# EasyEDA Pro project ProDoc_Avaota Pi A_2024-08-17.epro, schematic Avaota Pi A, sheets 1 to 5 of 13

## Sheets
1 POWER
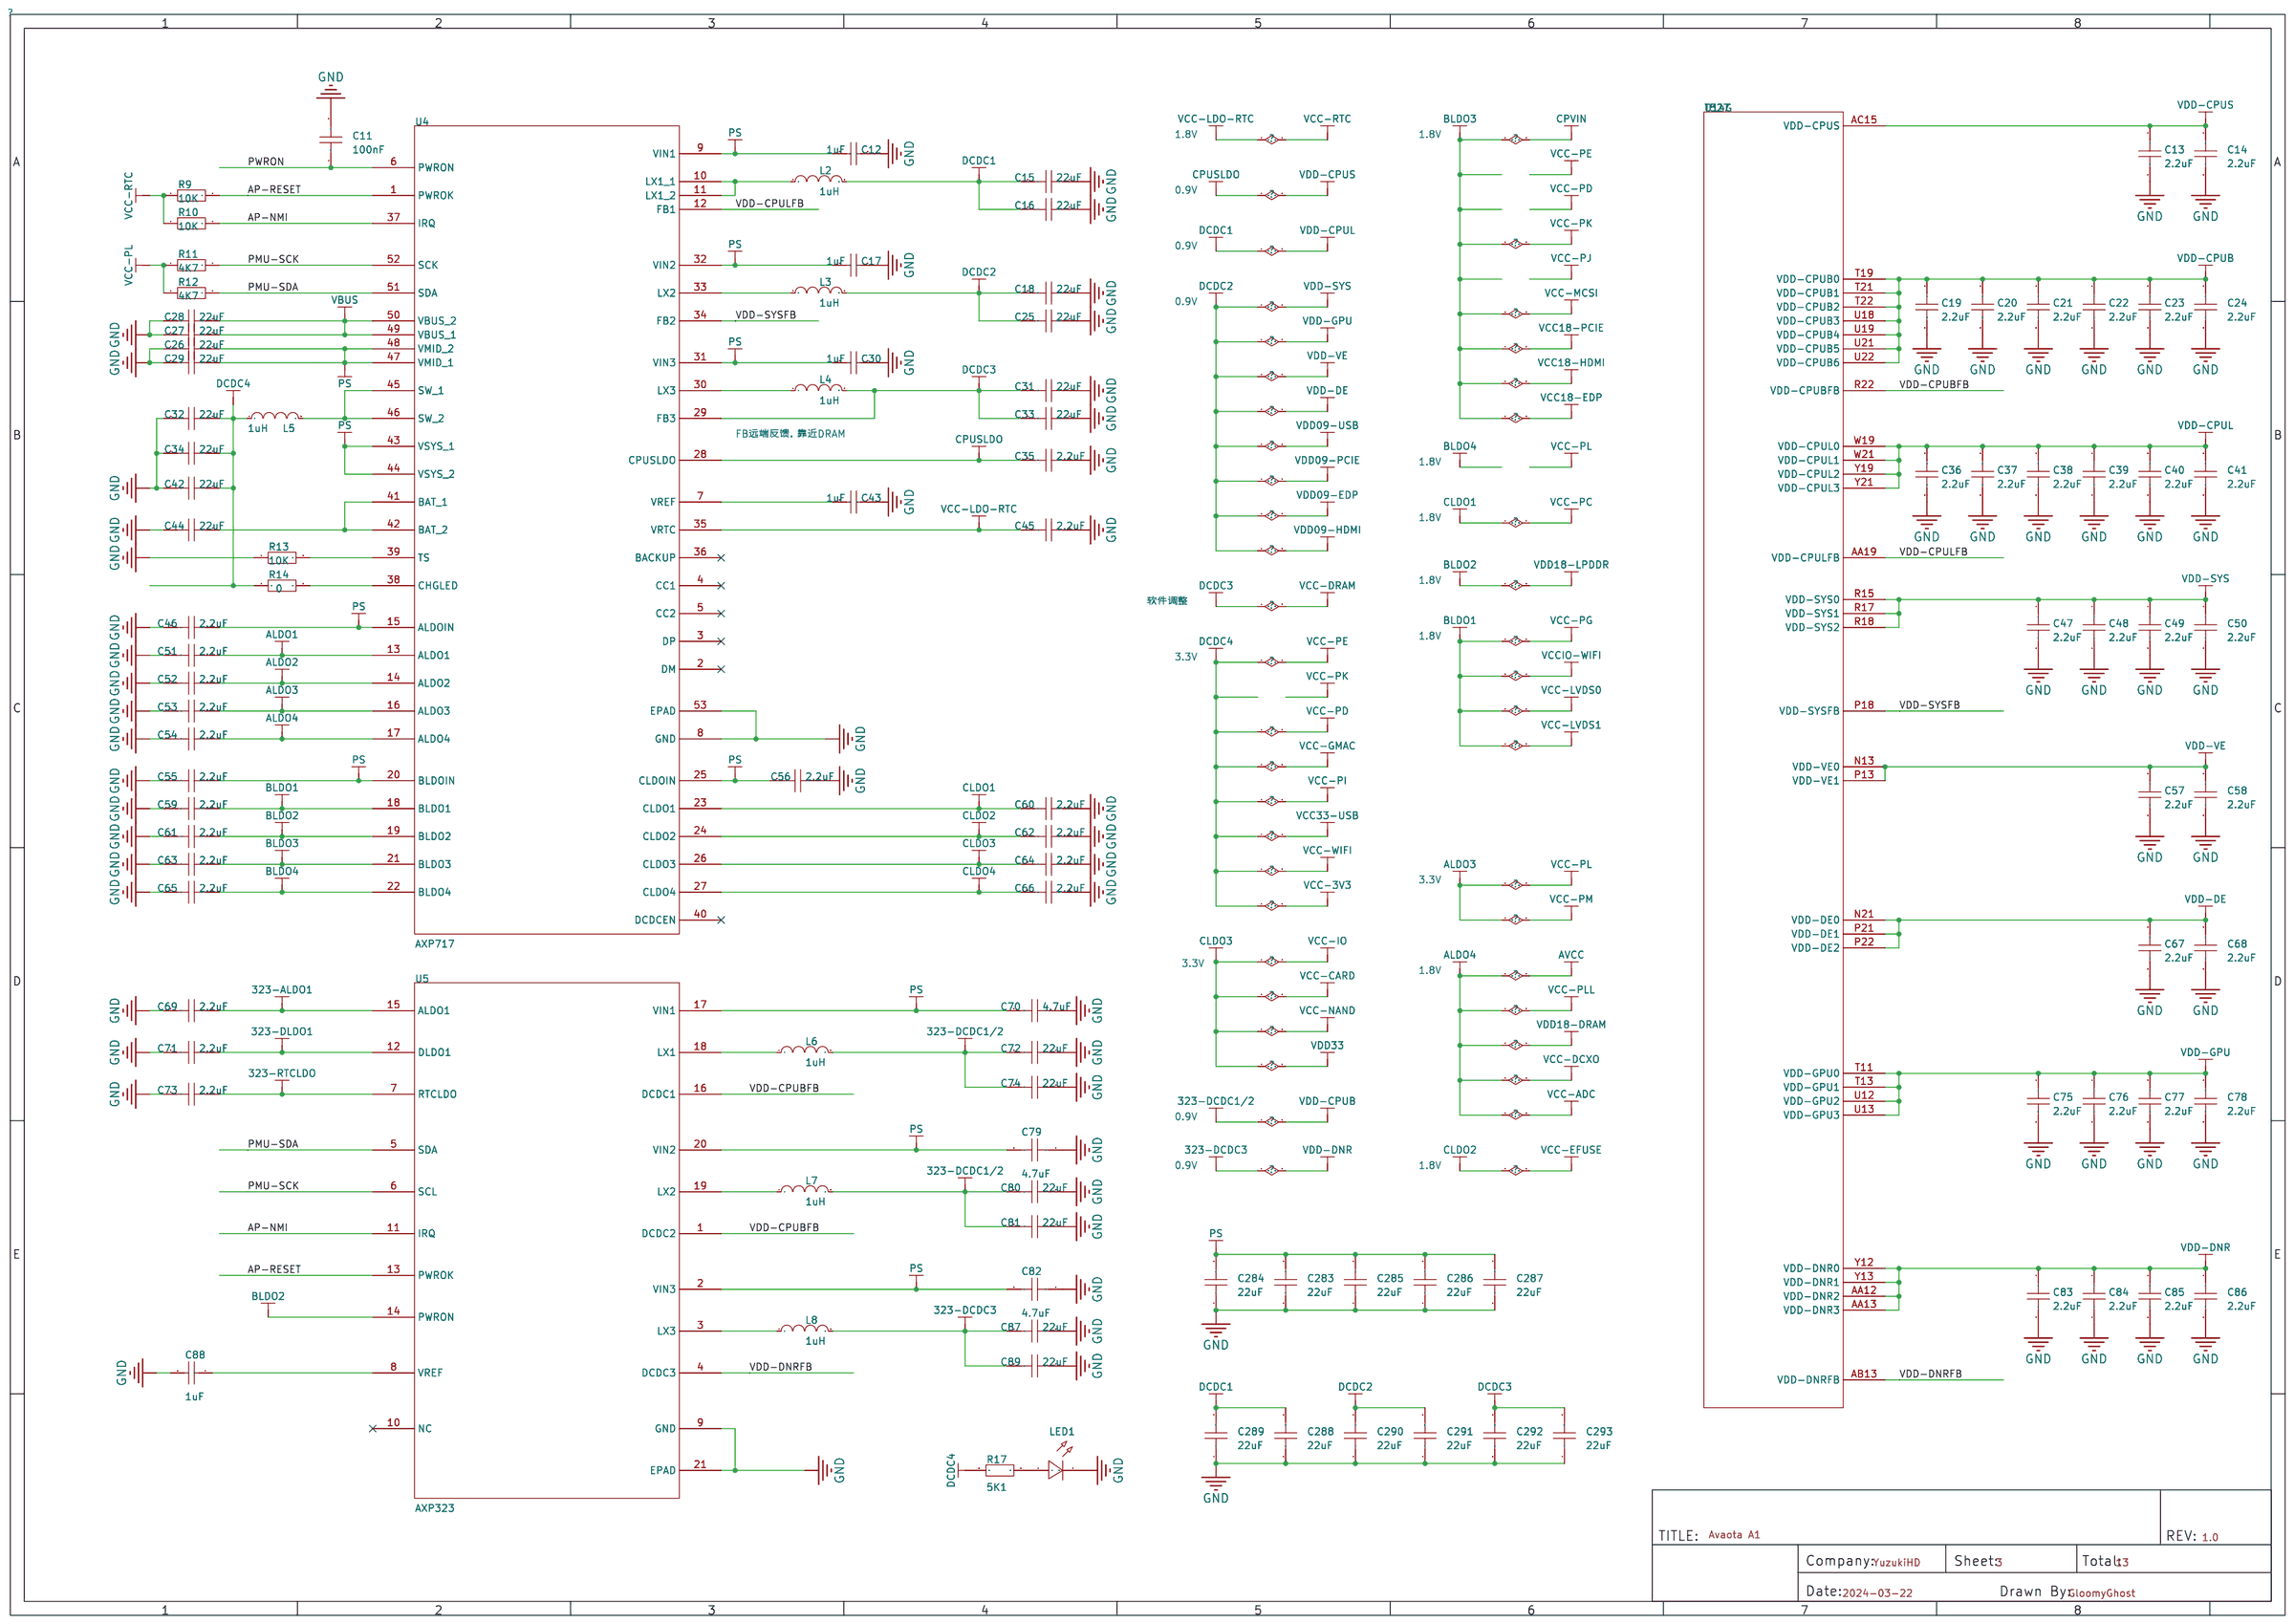
[diagram p0: POWER]
2 SYSTEM: Board Name: Avaota Pi A; Create Date: 2024-02-07; Page Name: SYSTEM; Project Name: Avaota A1 八核 AIoT 开发板; Schematic Name: Avaota Pi A; Update Date: 2024-05-12
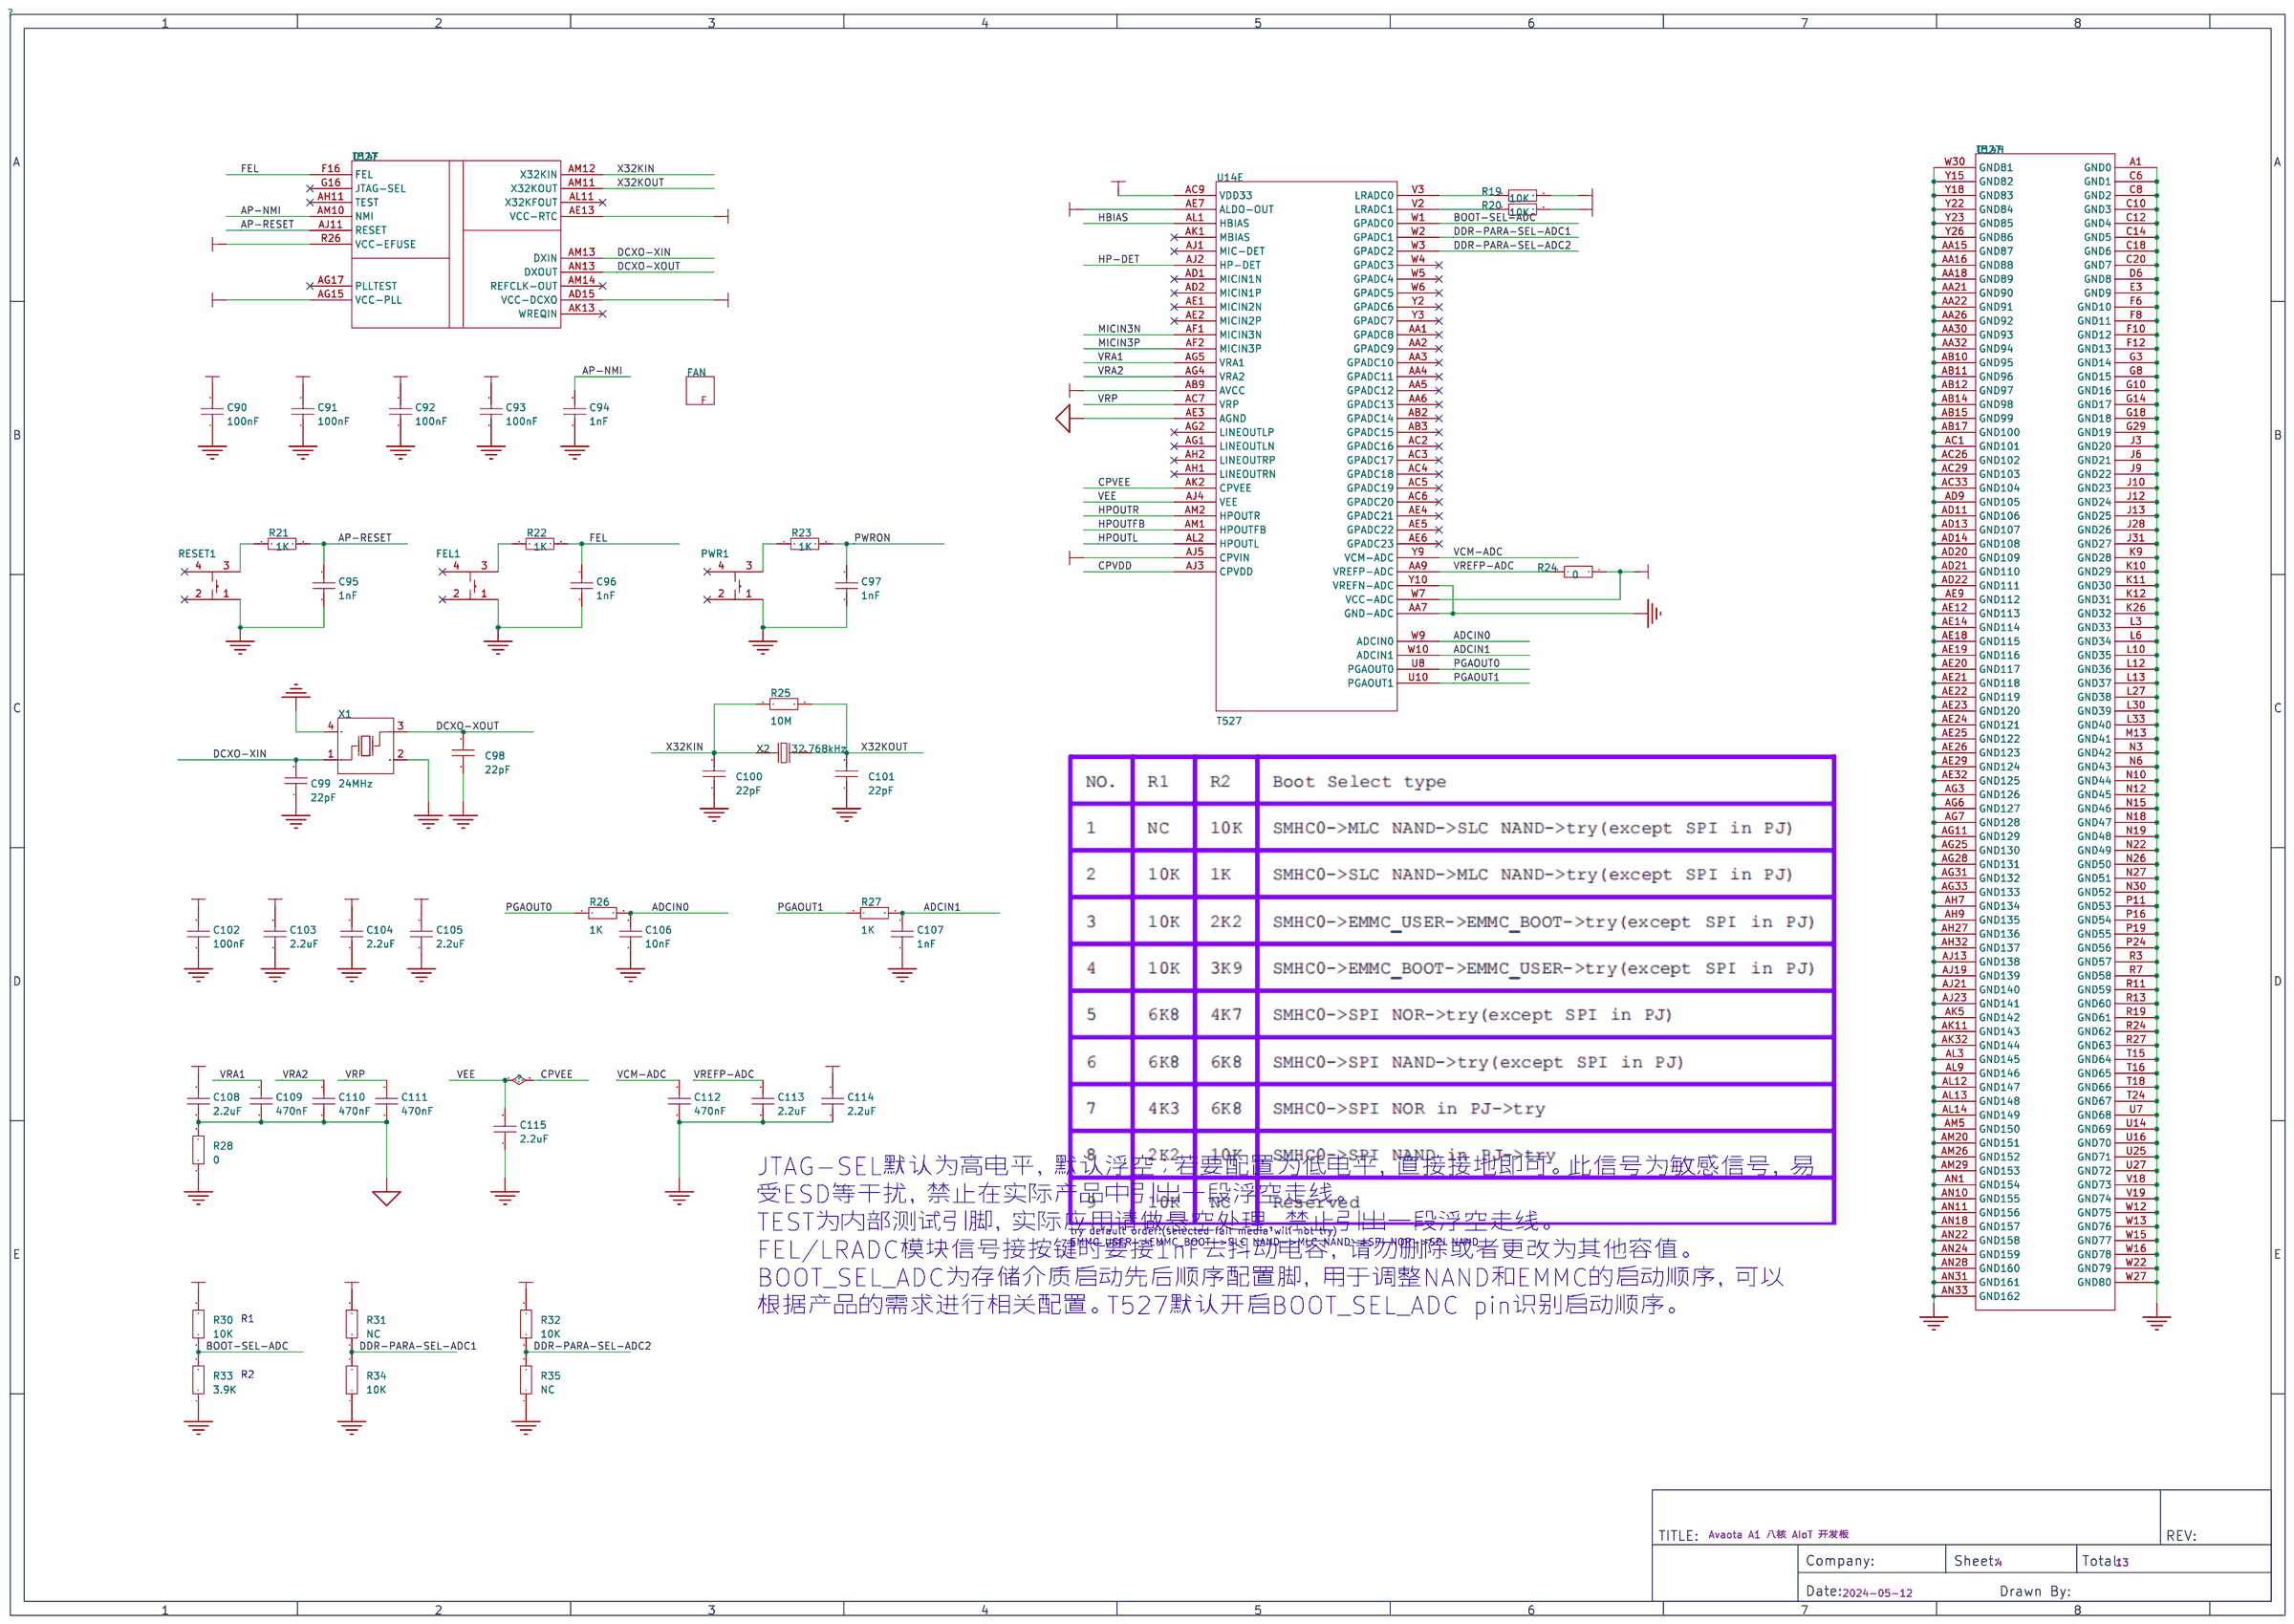
[diagram p1: SYSTEM]
3 DRAM
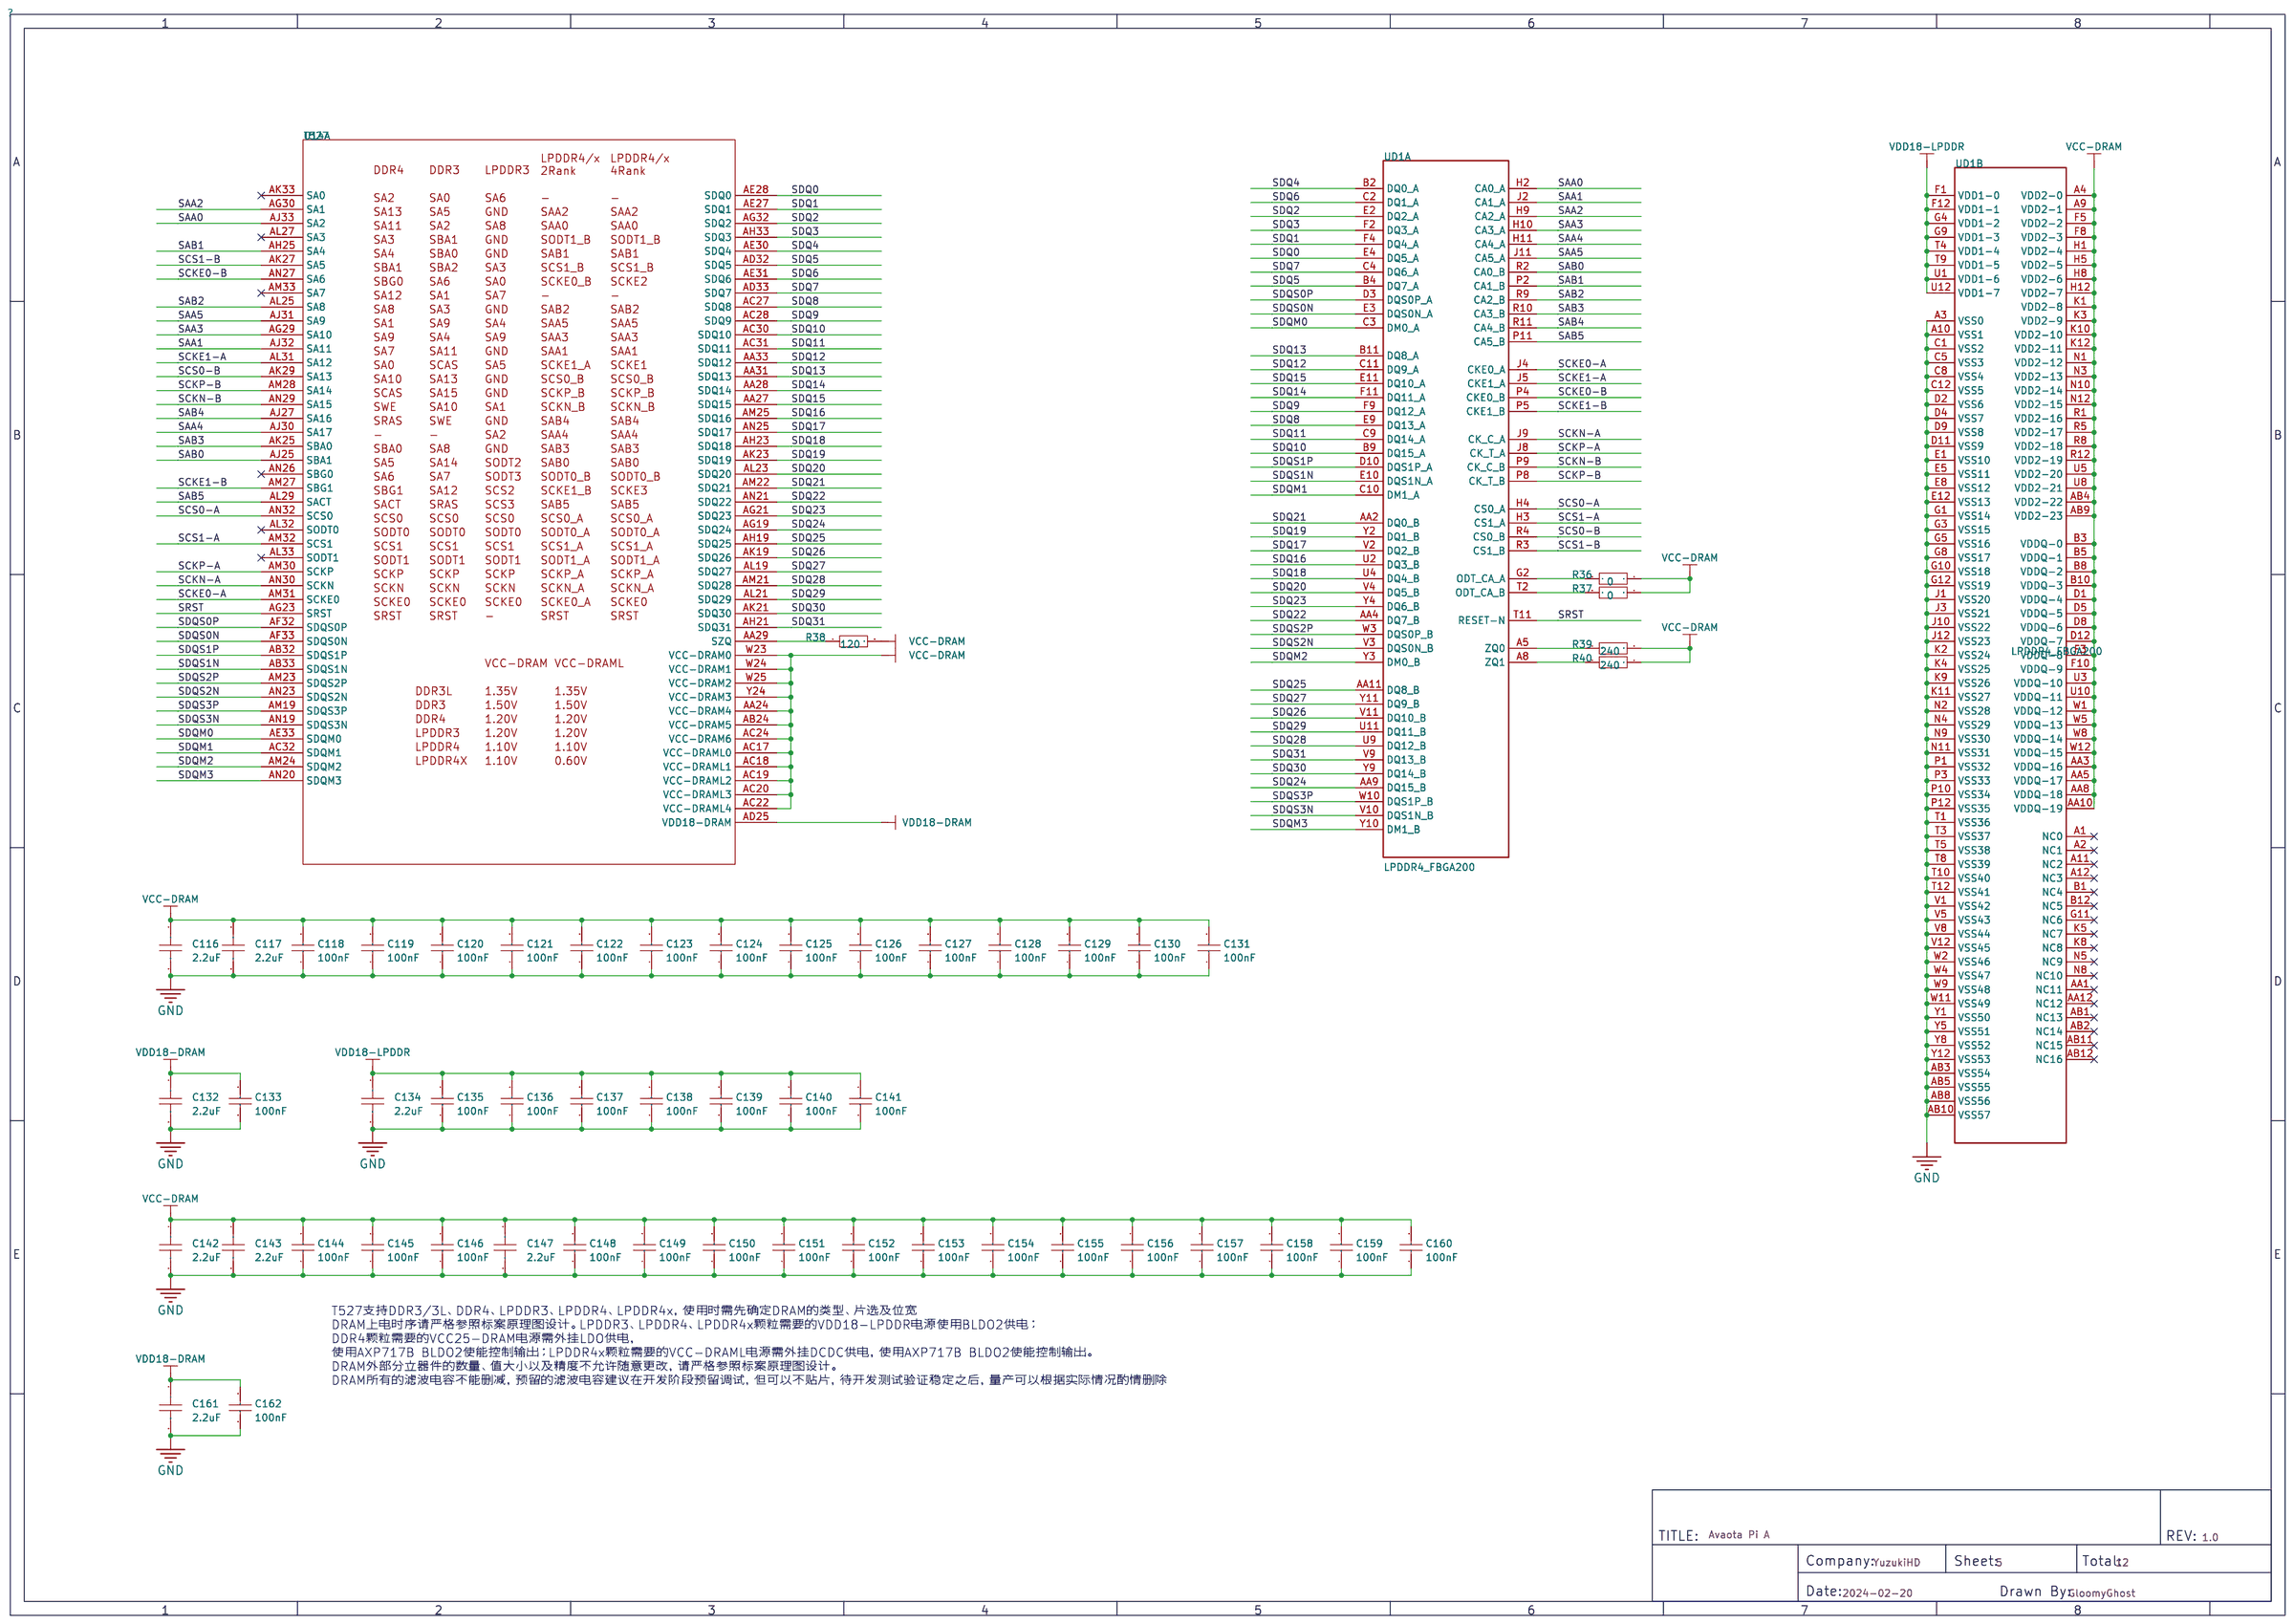
[diagram p2: DRAM]
4 GPIO1: Board Name: Avaota Pi A; Create Date: 2024-02-07; Page Name: GPIO1; Project Name: Avaota A1 八核 AIoT 开发板; Schematic Name: Avaota Pi A; Update Date: 2024-04-03
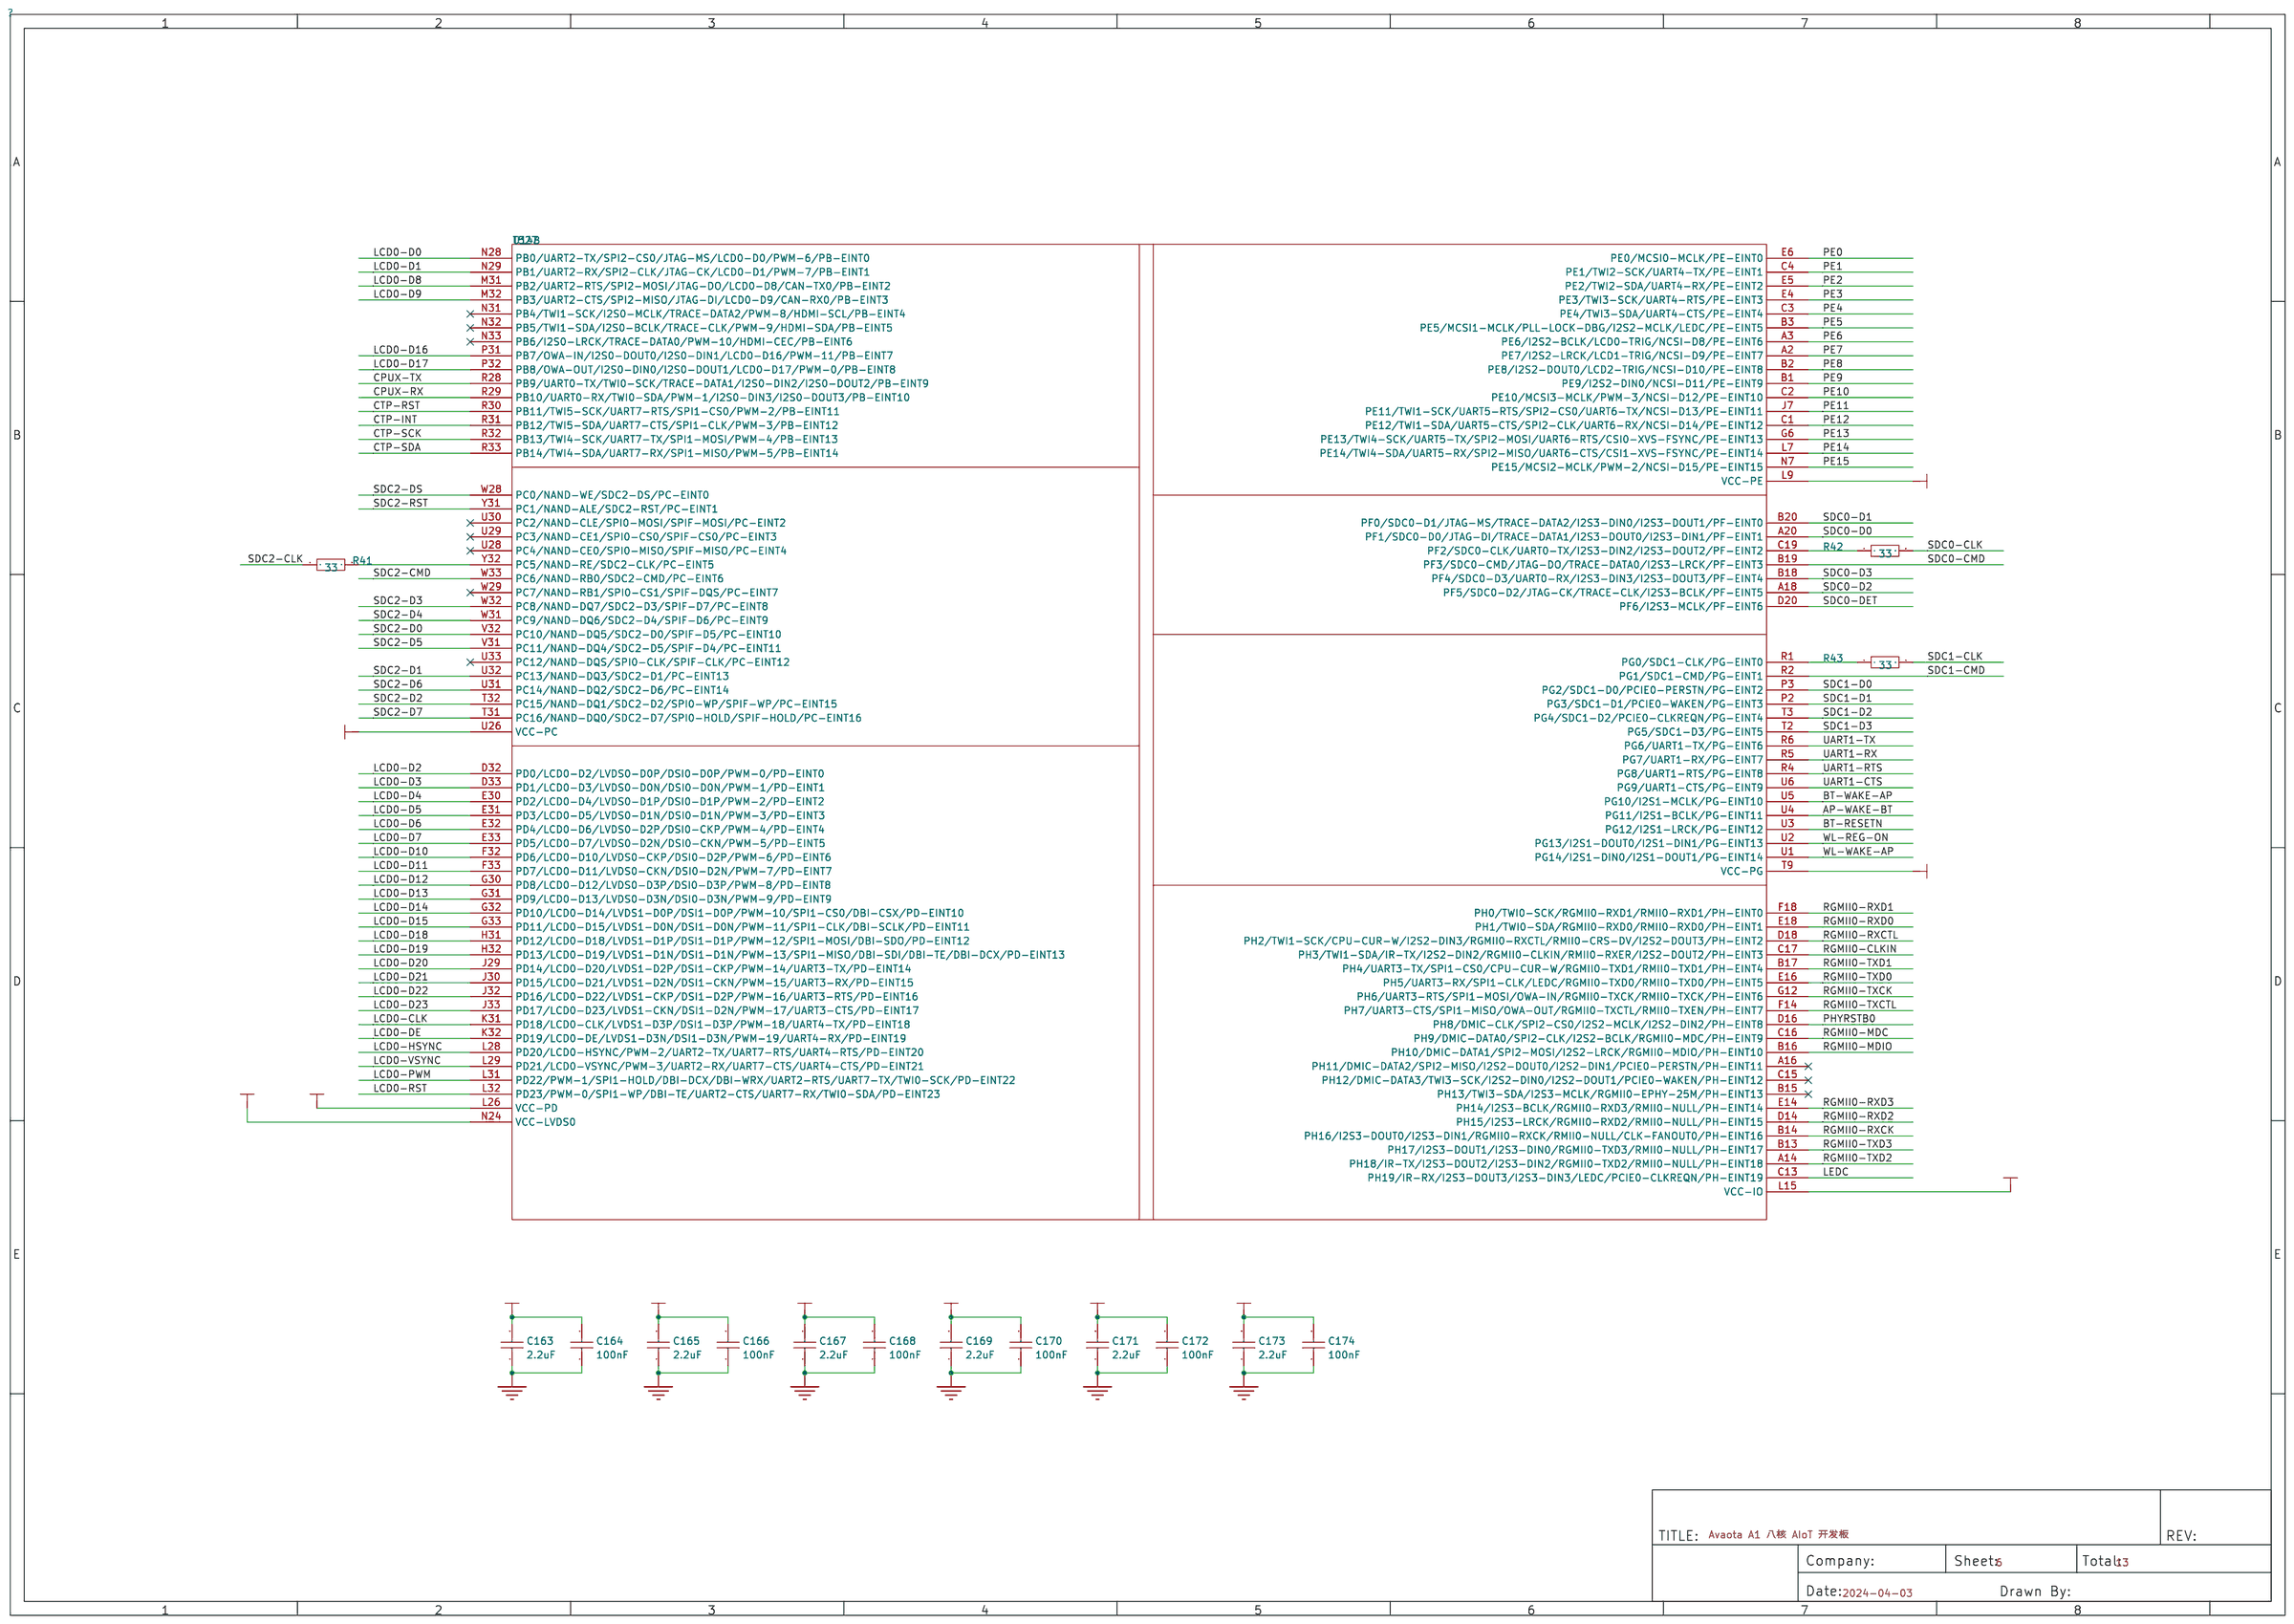
[diagram p3: GPIO1]
5 GPIO2
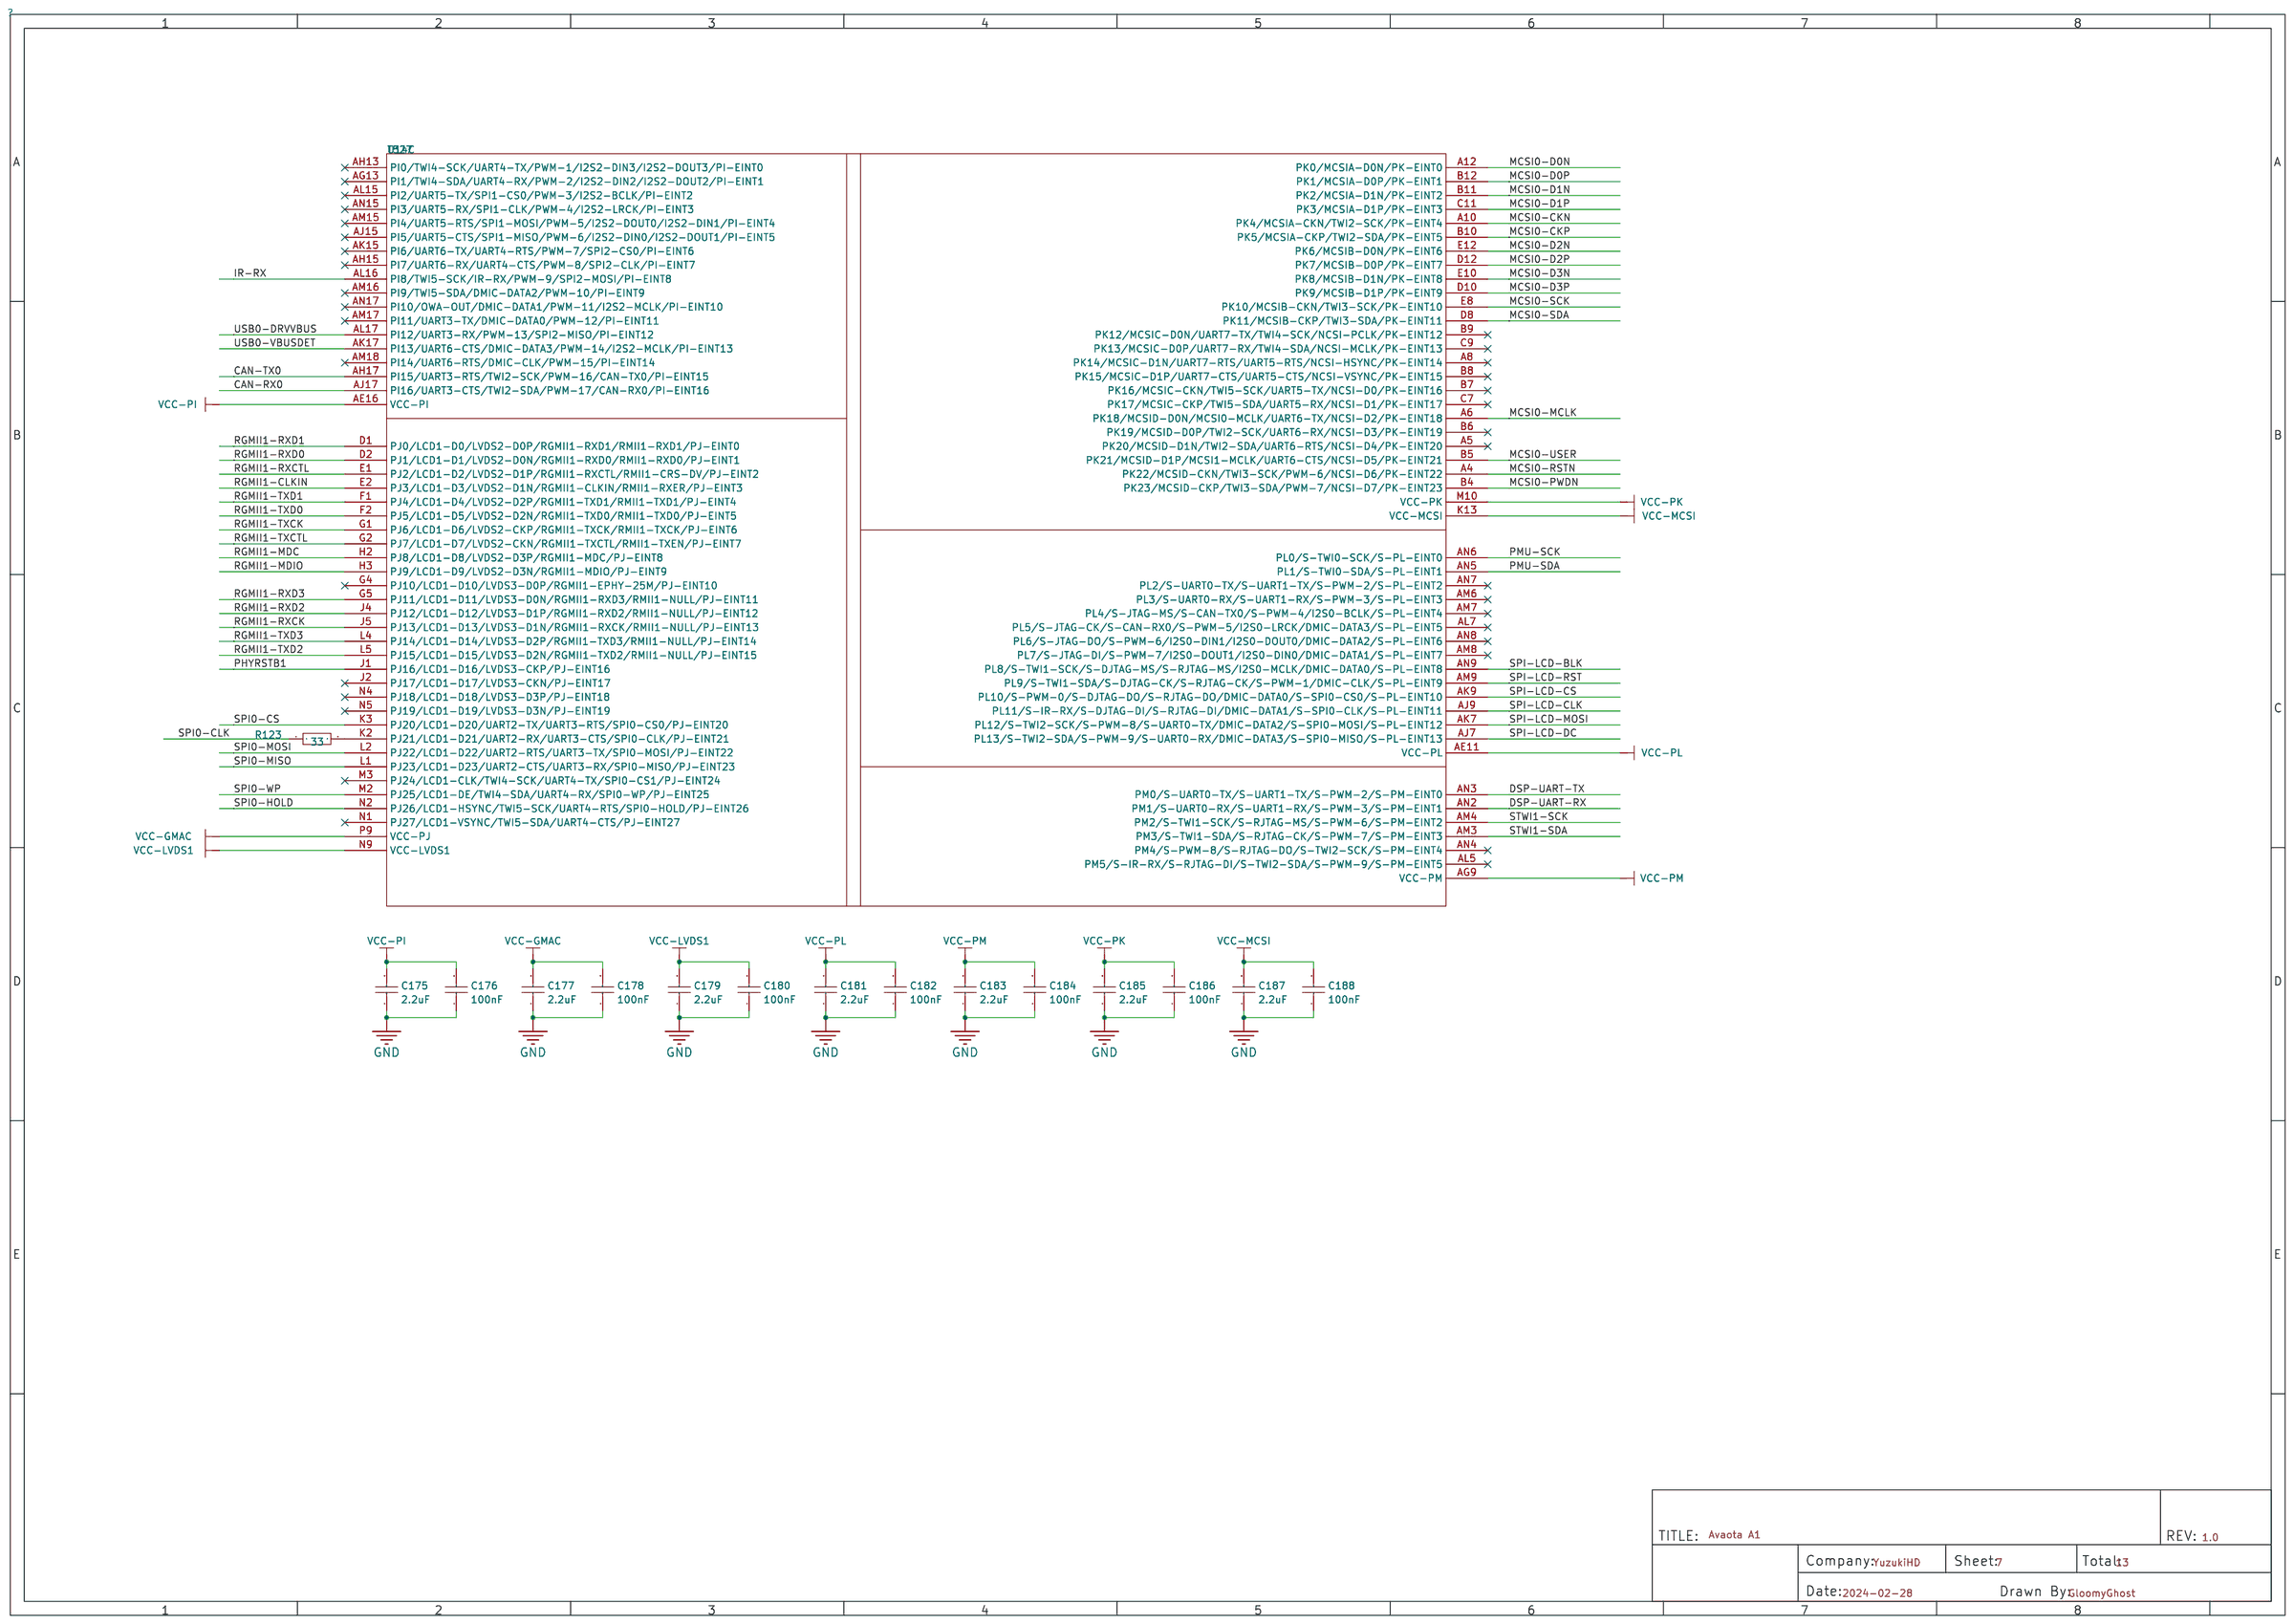
[diagram p4: GPIO2]

## Parts
sheet DRAM
C116  2.2uF  [c0201 nsk]
C117  2.2uF  [c0201 nsk]
C118  100nF  [c0201 nsk]
C119  100nF  [c0201 nsk]
C120  100nF  [c0201 nsk]
C121  100nF  [c0201 nsk]
C122  100nF  [c0201 nsk]
C123  100nF  [c0201 nsk]
C124  100nF  [c0201 nsk]
C125  100nF  [c0201 nsk]
C126  100nF  [c0201 nsk]
C127  100nF  [c0201 nsk]
C128  100nF  [c0201 nsk]
C129  100nF  [c0201 nsk]
C130  100nF  [c0201 nsk]
C131  100nF  [c0201 nsk]
C132  2.2uF  [c0201 nsk]
C133  100nF  [c0201 nsk]
C134  2.2uF  [c0201 nsk]
C135  100nF  [c0201 nsk]
C136  100nF  [c0201 nsk]
C137  100nF  [c0201 nsk]
C138  100nF  [c0201 nsk]
C139  100nF  [c0201 nsk]
C140  100nF  [c0201 nsk]
C141  100nF  [c0201 nsk]
C142  2.2uF  [c0201 nsk]
C143  2.2uF  [c0201 nsk]
C144  100nF  [c0201 nsk]
C145  100nF  [c0201 nsk]
C146  100nF  [c0201 nsk]
C147  2.2uF  [c0201 nsk]
C148  100nF  [c0201 nsk]
C149  100nF  [c0201 nsk]
C150  100nF  [c0201 nsk]
C151  100nF  [c0201 nsk]
C152  100nF  [c0201 nsk]
C153  100nF  [c0201 nsk]
C154  100nF  [c0201 nsk]
C155  100nF  [c0201 nsk]
C156  100nF  [c0201 nsk]
C157  100nF  [c0201 nsk]
C158  100nF  [c0201 nsk]
C159  100nF  [c0201 nsk]
C160  100nF  [c0201 nsk]
C161  2.2uF  [c0201 nsk]
C162  100nF  [c0201 nsk]
R36  0  [r0201 nsk]
R37  0  [r0201 nsk]
R38  120  [r0201 nsk]
R39  240  [r0201 nsk]
R40  240  [r0201 nsk]
UD1  LPDDR4_FBGA200  [BGA200P65_80B1000_1500H90]  (sections 1,2)
sheet GPIO1
C163  2.2uF  [c0201 nsk]
C164  100nF  [c0201 nsk]
C165  2.2uF  [c0201 nsk]
C166  100nF  [c0201 nsk]
C167  2.2uF  [c0201 nsk]
C168  100nF  [c0201 nsk]
C169  2.2uF  [c0201 nsk]
C170  100nF  [c0201 nsk]
C171  2.2uF  [c0201 nsk]
C172  100nF  [c0201 nsk]
C173  2.2uF  [c0201 nsk]
C174  100nF  [c0201 nsk]
R41  33  [r0201 nsk]
R42  33  [r0201 nsk]
R43  33  [r0201 nsk]
sheet GPIO2
C175  2.2uF  [c0201 nsk]
C176  100nF  [c0201 nsk]
C177  2.2uF  [c0201 nsk]
C178  100nF  [c0201 nsk]
C179  2.2uF  [c0201 nsk]
C180  100nF  [c0201 nsk]
C181  2.2uF  [c0201 nsk]
C182  100nF  [c0201 nsk]
C183  2.2uF  [c0201 nsk]
C184  100nF  [c0201 nsk]
C185  2.2uF  [c0201 nsk]
C186  100nF  [c0201 nsk]
C187  2.2uF  [c0201 nsk]
C188  100nF  [c0201 nsk]
R123  33  [r0201 nsk]
sheet POWER
C11  100nF  [c0201 nsk]
C12  1uF  [c0201 nsk]
C13  2.2uF  [c0201 nsk]
C14  2.2uF  [c0201 nsk]
C15  22uF  [c0402-nsk]
C16  22uF  [c0402-nsk]
C17  1uF  [c0201 nsk]
C18  22uF  [c0402-nsk]
C19  2.2uF  [c0201 nsk]
C20  2.2uF  [c0201 nsk]
C21  2.2uF  [c0201 nsk]
C22  2.2uF  [c0201 nsk]
C23  2.2uF  [c0201 nsk]
C24  2.2uF  [c0201 nsk]
C25  22uF  [c0402-nsk]
C26  22uF  [c0402-nsk]
C27  22uF  [C0603-NSK]
C28  22uF  [C0603-NSK]
C29  22uF  [c0402-nsk]
C30  1uF  [c0201 nsk]
C31  22uF  [c0402-nsk]
C32  22uF  [c0402-nsk]
C33  22uF  [c0402-nsk]
C34  22uF  [c0402-nsk]
C35  2.2uF  [c0201 nsk]
C36  2.2uF  [c0201 nsk]
C37  2.2uF  [c0201 nsk]
C38  2.2uF  [c0201 nsk]
C39  2.2uF  [c0201 nsk]
C40  2.2uF  [c0201 nsk]
C41  2.2uF  [c0201 nsk]
C42  22uF  [c0402-nsk]
C43  1uF  [c0201 nsk]
C44  22uF  [C0603-NSK]
C45  2.2uF  [c0201 nsk]
C46  2.2uF  [c0201 nsk]
C47  2.2uF  [c0201 nsk]
C48  2.2uF  [c0201 nsk]
C49  2.2uF  [c0201 nsk]
C50  2.2uF  [c0201 nsk]
C51  2.2uF  [c0201 nsk]
C52  2.2uF  [c0201 nsk]
C53  2.2uF  [c0201 nsk]
C54  2.2uF  [c0201 nsk]
C55  2.2uF  [c0201 nsk]
C56  2.2uF  [c0402-nsk]
C57  2.2uF  [c0201 nsk]
C58  2.2uF  [c0201 nsk]
C59  2.2uF  [c0201 nsk]
C60  2.2uF  [c0201 nsk]
C61  2.2uF  [c0201 nsk]
C62  2.2uF  [c0201 nsk]
C63  2.2uF  [c0201 nsk]
C64  2.2uF  [c0201 nsk]
C65  2.2uF  [c0201 nsk]
C66  2.2uF  [c0201 nsk]
C67  2.2uF  [c0201 nsk]
C68  2.2uF  [c0201 nsk]
C69  2.2uF  [c0201 nsk]
C70  4.7uF  [c0402-nsk]
C71  2.2uF  [c0201 nsk]
C72  22uF  [c0402-nsk]
C73  2.2uF  [c0201 nsk]
C74  22uF  [c0402-nsk]
C75  2.2uF  [c0201 nsk]
C76  2.2uF  [c0201 nsk]
C77  2.2uF  [c0201 nsk]
C78  2.2uF  [c0201 nsk]
C79  4.7uF  [c0402-nsk]
C80  22uF  [c0402-nsk]
C81  22uF  [c0402-nsk]
C82  4.7uF  [c0402-nsk]
C83  2.2uF  [c0201 nsk]
C84  2.2uF  [c0201 nsk]
C85  2.2uF  [c0201 nsk]
C86  2.2uF  [c0201 nsk]
C87  22uF  [c0402-nsk]
C88  1uF  [c0201 nsk]
C89  22uF  [c0402-nsk]
C283  22uF  [C0603-NSK]
C284  22uF  [C0603-NSK]
C285  22uF  [C0603-NSK]
C286  22uF  [C0603-NSK]
C287  22uF  [C0603-NSK]
C288  22uF  [C0603-NSK]
C289  22uF  [C0603-NSK]
C290  22uF  [C0603-NSK]
C291  22uF  [C0603-NSK]
C292  22uF  [C0603-NSK]
C293  22uF  [C0603-NSK]
L2  1uH  [ind-smd_l2.0-w1.6_1]
L3  1uH  [ind-smd_l2.0-w1.6_1]
L4  1uH  [ind-smd_l2.0-w1.6_1]
L5  1uH  [ind-smd_l2.0-w1.6_1]
L6  1uH  [ind-smd_l2.0-w1.6_1]
L7  1uH  [ind-smd_l2.0-w1.6_1]
L8  1uH  [ind-smd_l2.0-w1.6_1]
LED1  -  [RGBLED_0807]
R9  10K  [r0201 nsk]
R10  10K  [r0201 nsk]
R11  4K7  [r0201 nsk]
R12  4K7  [r0201 nsk]
R13  10K  [r0201 nsk]
R14  0  [r0201 nsk]
R17  5K1  [r0201 nsk]
U4  AXP717  [QFN-52_L6.0-W6.0-P0.40-BL-EP3.4-1]
U5  AXP323  [QFN-20_L3.0-W3.0-P0.40-BL-EP1.5]
U14  T527  [T527-BGA664]  (sections Audio_ADC,DRAM,GND,IO_1,IO_2,PERF,SoC,VCC)
sheet SYSTEM
C90  100nF  [c0201 nsk]
C91  100nF  [c0201 nsk]
C92  100nF  [c0201 nsk]
C93  100nF  [c0201 nsk]
C94  1nF  [c0201 nsk]
C95  1nF  [c0201 nsk]
C96  1nF  [c0201 nsk]
C97  1nF  [c0201 nsk]
C98  22pF  [c0201 nsk]
C99  22pF  [c0201 nsk]
C100  22pF  [c0201 nsk]
C101  22pF  [c0201 nsk]
C102  100nF  [c0201 nsk]
C103  2.2uF  [c0201 nsk]
C104  2.2uF  [c0201 nsk]
C105  2.2uF  [c0201 nsk]
C106  10nF  [c0201 nsk]
C107  1nF  [c0201 nsk]
C108  2.2uF  [c0201 nsk]
C109  470nF  [c0201 nsk]
C110  470nF  [c0201 nsk]
C111  470nF  [c0201 nsk]
C112  470nF  [c0201 nsk]
C113  2.2uF  [c0201 nsk]
C114  2.2uF  [c0201 nsk]
C115  2.2uF  [c0201 nsk]
FAN  -  [FAN2510]
FEL1  YTSA016A0252501B  [SW-SMD_4P-L4.2-W3.4-P2.15-LS4.5-TL]
PWR1  YTSA016A0252501B  [SW-SMD_4P-L4.2-W3.4-P2.15-LS4.5-TL]
R19  10K  [r0201 nsk]
R20  10K  [r0201 nsk]
R21  1K  [r0201 nsk]
R22  1K  [r0201 nsk]
R23  1K  [r0201 nsk]
R24  0  [r0201 nsk]
R25  10M  [r0201 nsk]
R26  1K  [r0201 nsk]
R27  1K  [r0201 nsk]
R28  0  [R0402-NSK]
R30  10K  [r0201 nsk]
R31  NC  [r0201 nsk]
R32  10K  [r0201 nsk]
R33  3.9K  [r0201 nsk]
R34  10K  [r0201 nsk]
R35  NC  [r0201 nsk]
RESET1  YTSA016A0252501B  [SW-SMD_4P-L4.2-W3.4-P2.15-LS4.5-TL]
X1  24MHz  [crystal-smd_4p-l2.0-w1.6-bl-nsk]
X2  32.768kHz  [osc-smd_l3.2-w1.5 nsk]

## Library data of the parts
C13 C14 C19-C24 C35-C41 C45-C55 C57-C69 C71 C73 C75-C78 C83-C86 C116 C117 C132 C134 C142 C143 C147 C161 = 0201X225M6R3NT: 容值:2.2uF;精度:±20%;额定电压:6.3V;材质(温度系数):X5R;; LCSC Part Name: 2.2uF ±20% 6.3V; Supplier Part: C285111; Manufacturer: FH(风华); Supplier Footprint: 0201; JLCPCB Part Class: 扩展库; Datasheet: https://atta.szlcsc.com/upload/public/pdf/source/20180913/C285111_405173511BA094D64E8CAA96F7E40A73.pdf; Supplier: LCSC; Tolerance: ±20%; Voltage Rated: 6.3V; Temperature Coefficient: X5R
C90-C97 C102-C115 C118-C131 C133 C135-C141 C144-C146 C148-C160 C162-C188 = GRM033R61A104KE15D: 容值:100nF;精度:±10%;额定电压:10V;材质(温度系数):X5R;; LCSC Part Name: 100nF ±10% 10V; Supplier Part: C76934; Manufacturer: muRata(村田); Supplier Footprint: 0201; JLCPCB Part Class: Extended Part; Datasheet: https://atta.szlcsc.com/upload/public/pdf/source/20180307/C76934_15204090982891407723.pdf; Supplier: LCSC; Tolerance: ±10%; Voltage Rated: 10V; Temperature Coefficient: X5R
R9-R14 R17 R19-R27 R30-R43 R123 = Res_0201: Supplier Footprint: 0201
UD1 = LPDDR4_FBGA200: SWAP_INFO: (S1+S2); SPLIT_INST: TRUE
C11 = GRM033R60J104KE19D: 容值:100nF;精度:±10%;额定电压:6.3V;材质(温度系数):X5R;; LCSC Part Name: 100nF ±10% 6.3V; Supplier Part: C76928; Manufacturer: muRata(村田); Supplier Footprint: 0201; JLCPCB Part Class: 扩展库; Datasheet: https://atta.szlcsc.com/upload/public/pdf/source/20180307/C76928_15204090936861407718.pdf; Supplier: LCSC; Tolerance: ±10%; Voltage Rated: 6.3V; Temperature Coefficient: X5R
C12 C17 C30 C43 C88 = GRM033R61A105ME44D: 容值:1uF;精度:±20%;额定电压:10V;材质(温度系数):X5R;; LCSC Part Name: 1uF ±20% 10V; Supplier Part: C76935; Manufacturer: muRata(村田); Supplier Footprint: 0201; JLCPCB Part Class: 扩展库; Datasheet: https://atta.szlcsc.com/upload/public/pdf/source/20190904/C426118_85E81C7C1F21FC87C5FB6D536E0847B4.pdf; Supplier: LCSC; Tolerance: ±20%; Voltage Rated: 10V; Temperature Coefficient: X5R
C15 C16 C18 C25 C26 C29 C31-C34 C42 C72 C74 C80 C81 C87 C89 = GRM155R60J226ME11D: 容值:22uF;精度:±20%;额定电压:6.3V;材质(温度系数):X5R;; LCSC Part Name: 22uF ±20% 6.3V; Supplier Part: C415703; Manufacturer: muRata(村田); Supplier Footprint: 0402; JLCPCB Part Class: 扩展库; Datasheet: https://atta.szlcsc.com/upload/public/pdf/source/20200305/C490387_23319AE8C154DEB24C505E6C82A8106A.pdf; Supplier: LCSC; Tolerance: ±20%; Voltage Rated: 6.3V; Temperature Coefficient: X5R
C27 C28 C44 C283-C293 = CL10A226MP8NUNE: 容值:22uF;精度:±20%;额定电压:10V;材质(温度系数):X5R;; LCSC Part Name: 22uF ±20% 10V; Supplier Part: C86295; Manufacturer: SAMSUNG(三星); Supplier Footprint: 0603; JLCPCB Part Class: 扩展库; Datasheet: https://atta.szlcsc.com/upload/public/pdf/source/20160218/1457707763339.pdf; Supplier: LCSC; Tolerance: ±20%; Voltage Rated: 10V; Temperature Coefficient: X5R
C56 = CL05A225KP5NSNC: 容值:2.2uF;精度:±10%;额定电压:10V;材质(温度系数):X5R;; LCSC Part Name: 2.2uF ±10% 10V; Supplier Part: C107369; Manufacturer: SAMSUNG(三星); Supplier Footprint: 0402; JLCPCB Part Class: Extended Part; Datasheet: https://atta.szlcsc.com/upload/public/pdf/source/20181106/C107369_263F7070671EA24F6B8C8282DA15FA22.pdf; Supplier: LCSC; Tolerance: ±10%; Voltage Rated: 10V; Temperature Coefficient: X5R
C70 C79 C82 = CL05A475KP5NRNC: 容值:4.7uF;精度:±10%;额定电压:10V;材质(温度系数):X5R;; LCSC Part Name: 4.7uF ±10% 10V; Supplier Part: C368809; Manufacturer: SAMSUNG(三星); Supplier Footprint: 0402; JLCPCB Part Class: 扩展库; Datasheet: https://atta.szlcsc.com/upload/public/pdf/source/20160218/1457707763339.pdf; Supplier: LCSC; Tolerance: ±10%; Voltage Rated: 10V; Temperature Coefficient: X5R
L2-L8 = TFM201610ALM-1R0MTAA: 电感值:1uH;精度:±20%;额定电流:3.1A;饱和电流(Isat):4.3A;直流电阻(DCR):50mΩ;; LCSC Part Name: 1uH ±20% 4.3A 50mΩ; Supplier Part: C598616; Manufacturer: TDK; Supplier Footprint: SMD,1.6x2mm; JLCPCB Part Class: 扩展库; Datasheet: https://atta.szlcsc.com/upload/public/pdf/source/20200701/C598616_EE42BAB5AE3B7612345364C4F9ECDC9F.pdf; Supplier: LCSC; Tolerance: ±20%; Rated Current: 3.1A; Saturation Current (Isat): 4.3A; DC Resistance (DCR): 50mΩ
LED1 = LED_0807-RGB: Supplier Footprint: 0805
U4 = AXP717B
U5 = AXP323
U14 = T527: Allwinner T527 SoC; SWAP_INFO: (S1+S2+S3+S4+S5+S6+S7+S8+S9); SPLIT_INST: TRUE
C98-C101 = 0201CG220J500NT: 容值:22pF;精度:±5%;额定电压:50V;材质(温度系数):C0G;; LCSC Part Name: 22pF ±5% 50V; Supplier Part: C57783; Manufacturer: FH(风华); Supplier Footprint: 0201; JLCPCB Part Class: 扩展库; Datasheet: https://atta.szlcsc.com/upload/public/pdf/source/20200305/C486355_26A10D38EF8C2A5C37091D0039909270.pdf; Supplier: LCSC; Tolerance: ±5%; Voltage Rated: 50V; Temperature Coefficient: C0G
FAN = FAN2510
FEL1 PWR1 RESET1 = YTSA016A0252501B: 电路结构:单刀单掷;按钮形状:椭圆形按钮;作用力:250gf;安装方式:立贴;开关长度:4.2mm;开关宽度:3.4mm;开关高度:2.5mm;带支架:不带;触点电流:50mA;额定电压(DC):12V;绝缘电阻:100MΩ;机械寿命:10万次;; LCSC Part Name: 4.2*3.4*2.5mm 立贴 轻触开关; Supplier Part: C967791; Manufacturer: DGBZ(东莞博众); Supplier Footprint: SMD; JLCPCB Part Class: 扩展库; Datasheet: https://atta.szlcsc.com/upload/public/pdf/source/20201210/C967791_DCF099188004B981ADA3DDF2841F8914.pdf; Supplier: LCSC; Circuit: 单刀单掷; Actuator Style: 椭圆形按钮; Operating Force: 250gf; Mounting Style: 立贴; Switch Length: 4.2mm; Switch Width: 3.4mm; Switch Height: 2.5mm; Strike Gundam: 不带; Contact Current: 50mA; Voltage Rating (DC): 12V; Insulation Resistance: 100MΩ; Actuator/Cap Color: 白色; Pin Style: J型引脚; Mechanical Life: 10万次
R28 = Res_0402: Supplier Footprint: 0402
X1 = TAXM24M4ZDBCCT2T: 晶振类型:贴片无源晶振;频率:24MHz;常温频差:±20ppm;负载电容:10pF;频率稳定度(全温):±15ppm;; LCSC Part Name: 24MHz ±20ppm 10pF; Supplier Part: C388793; Manufacturer: YJX(雅晶鑫); Supplier Footprint: SMD2016-4P; JLCPCB Part Class: 扩展库; Datasheet: https://atta.szlcsc.com/upload/public/pdf/source/20190419/C388793_192353B16CD053644393BCEECA40F8D0.pdf; Supplier: LCSC; Crystal Type: 贴片无源晶振; Normal temperature Frequency Tolerance: ±20ppm; Load Capacitance: 10pF; Frequency Stability(Full temperature range): ±15ppm; Equivalent Series Resistance (ESR): 80Ω; Operating Temperature: -40℃~+85℃
X2 = Q13FC1350000400: 频率:32.768kHz;负载电容:12.5pF;频率公差:±20ppm;; LCSC Part Name: 32.768kHz ±20ppm 12.5pF; Supplier Part: C32346; Manufacturer: EPSON(爱普生); Supplier Footprint: SMD3215-2P; JLCPCB Part Class: 基础库; Datasheet: https://atta.szlcsc.com/upload/public/pdf/source/20190108/C32346_746D6B07EAF90824457A96480007685F.pdf; Supplier: LCSC; Crystal Type: 贴片无源晶振; Load Capacitance: 12.5pF; Equivalent Series Resistance (ESR): 70kΩ; Frequency Tolerance: ±20ppm; Operating Temperature: -40℃~+85℃

## Nets
AGND: C108.1 C109.1 C110.1 C111.1 R28.2 U14.AE3(AGND)
GND: C11.2 C12.2 C13.2 C14.2 C15.1 C16.1 C17.2 C18.1 C19.2 C20.2 C21.2 C22.2 C23.2 C24.2 C25.1 C26.2 C27.1 C28.1 C29.2 C30.2 C31.1 C32.2 C33.1 C34.2 C35.1 C36.2 C37.2 C38.2 C39.2 C40.2 C41.2 C42.2 C43.2 C44.1 C45.1 C46.2 C47.2 C48.2 C49.2 C50.2 C51.2 C52.2 C53.2 C54.2 C55.2 C56.1 C57.2 C58.2 C59.2 C60.1 C61.2 C62.1 C63.2 C64.1 C65.2 C66.1 C67.2 C68.2 C69.2 C70.1 C71.2 C72.1 C73.2 C74.1 C75.2 C76.2 C77.2 C78.2 C79.1 C80.1 C81.1 C82.1 C83.2 C84.2 C85.2 C86.2 C87.1 C88.2 C89.1 C90.1 C91.1 C92.1 C93.1 C94.1 C95.1 C96.1 C97.1 C98.1 C99.1 C100.1 C101.1 C102.1 C103.1 C104.1 C105.1 C106.1 C107.1 C112.1 C113.1 C114.1 C115.1 C116.2 C117.2 C118.1 C119.1 C120.1 C121.1 C122.1 C123.1 C124.1 C125.1 C126.1 C127.1 C128.1 C129.1 C130.1 C131.1 C132.2 C133.1 C134.2 C135.1 C136.1 C137.1 C138.1 C139.1 C140.1 C141.1 C142.2 C143.2 C144.1 C145.1 C146.1 C147.2 C148.1 C149.1 C150.1 C151.1 C152.1 C153.1 C154.1 C155.1 C156.1 C157.1 C158.1 C159.1 C160.1 C161.2 C162.1 C163.1 C164.1 C165.1 C166.1 C167.1 C168.1 C169.1 C170.1 C171.1 C172.1 C173.1 C174.1 C175.1 C176.1 C177.1 C178.1 C179.1 C180.1 C181.1 C182.1 C183.1 C184.1 C185.1 C186.1 C187.1 C188.1 C283.1 C284.1 C285.1 C286.1 C287.1 C288.1 C289.1 C290.1 C291.1 C292.1 C293.1 FEL1.1 LED1.2(C) PWR1.1 R13.1 R28.1 R33.1 R34.1 R35.1 RESET1.1 U4.8(GND) U4.53(EPAD) U5.9(GND) U5.21(EPAD) U14.A1(GND0) U14.AA7(GND-ADC) U14.AA15(GND87) U14.AA16(GND88) U14.AA18(GND89) U14.AA21(GND90) U14.AA22(GND91) U14.AA26(GND92) U14.AA30(GND93) U14.AA32(GND94) U14.AB10(GND95) U14.AB11(GND96) U14.AB12(GND97) U14.AB14(GND98) U14.AB15(GND99) U14.AB17(GND100) U14.AC1(GND101) U14.AC26(GND102) U14.AC29(GND103) U14.AC33(GND104) U14.AD9(GND105) U14.AD11(GND106) U14.AD13(GND107) U14.AD14(GND108) U14.AD20(GND109) U14.AD21(GND110) U14.AD22(GND111) U14.AE9(GND112) U14.AE12(GND113) U14.AE14(GND114) U14.AE18(GND115) U14.AE19(GND116) U14.AE20(GND117) U14.AE21(GND118) U14.AE22(GND119) U14.AE23(GND120) U14.AE24(GND121) U14.AE25(GND122) U14.AE26(GND123) U14.AE29(GND124) U14.AE32(GND125) U14.AG3(GND126) U14.AG6(GND127) U14.AG7(GND128) U14.AG11(GND129) U14.AG25(GND130) U14.AG28(GND131) U14.AG31(GND132) U14.AG33(GND133) U14.AH7(GND134) U14.AH9(GND135) U14.AH27(GND136) U14.AH32(GND137) U14.AJ13(GND138) U14.AJ19(GND139) U14.AJ21(GND140) U14.AJ23(GND141) U14.AK5(GND142) U14.AK11(GND143) U14.AK32(GND144) U14.AL3(GND145) U14.AL9(GND146) U14.AL12(GND147) U14.AL13(GND148) U14.AL14(GND149) U14.AM5(GND150) U14.AM20(GND151) U14.AM26(GND152) U14.AM29(GND153) U14.AN1(GND154) U14.AN10(GND155) U14.AN11(GND156) U14.AN18(GND157) U14.AN22(GND158) U14.AN24(GND159) U14.AN28(GND160) U14.AN31(GND161) U14.AN33(GND162) U14.C6(GND1) U14.C8(GND2) U14.C10(GND3) U14.C12(GND4) U14.C14(GND5) U14.C18(GND6) U14.C20(GND7) U14.D6(GND8) U14.E3(GND9) U14.F6(GND10) U14.F8(GND11) U14.F10(GND12) U14.F12(GND13) U14.G3(GND14) U14.G8(GND15) U14.G10(GND16) U14.G14(GND17) U14.G18(GND18) U14.G29(GND19) U14.J3(GND20) U14.J6(GND21) U14.J9(GND22) U14.J10(GND23) U14.J12(GND24) U14.J13(GND25) U14.J28(GND26) U14.J31(GND27) U14.K9(GND28) U14.K10(GND29) U14.K11(GND30) U14.K12(GND31) U14.K26(GND32) U14.L3(GND33) U14.L6(GND34) U14.L10(GND35) U14.L12(GND36) U14.L13(GND37) U14.L27(GND38) U14.L30(GND39) U14.L33(GND40) U14.M13(GND41) U14.N3(GND42) U14.N6(GND43) U14.N10(GND44) U14.N12(GND45) U14.N15(GND46) U14.N18(GND47) U14.N19(GND48) U14.N22(GND49) U14.N26(GND50) U14.N27(GND51) U14.N30(GND52) U14.P11(GND53) U14.P16(GND54) U14.P19(GND55) U14.P24(GND56) U14.R3(GND57) U14.R7(GND58) U14.R11(GND59) U14.R13(GND60) U14.R19(GND61) U14.R24(GND62) U14.R27(GND63) U14.T15(GND64) U14.T16(GND65) U14.T18(GND66) U14.T24(GND67) U14.U7(GND68) U14.U14(GND69) U14.U16(GND70) U14.U25(GND71) U14.U27(GND72) U14.V18(GND73) U14.V19(GND74) U14.W12(GND75) U14.W13(GND76) U14.W15(GND77) U14.W16(GND78) U14.W22(GND79) U14.W27(GND80) U14.W30(GND81) U14.Y10(VREFN-ADC) U14.Y15(GND82) U14.Y18(GND83) U14.Y22(GND84) U14.Y23(GND85) U14.Y26(GND86) UD1.A3(VSS0) UD1.A10(VSS1) UD1.AB3(VSS54) UD1.AB5(VSS55) UD1.AB8(VSS56) UD1.AB10(VSS57) UD1.C1(VSS2) UD1.C5(VSS3) UD1.C8(VSS4) UD1.C12(VSS5) UD1.D2(VSS6) UD1.D4(VSS7) UD1.D9(VSS8) UD1.D11(VSS9) UD1.E1(VSS10) UD1.E5(VSS11) UD1.E8(VSS12) UD1.E12(VSS13) UD1.G1(VSS14) UD1.G3(VSS15) UD1.G5(VSS16) UD1.G8(VSS17) UD1.G10(VSS18) UD1.G12(VSS19) UD1.J1(VSS20) UD1.J3(VSS21) UD1.J10(VSS22) UD1.J12(VSS23) UD1.K2(VSS24) UD1.K4(VSS25) UD1.K9(VSS26) UD1.K11(VSS27) UD1.N2(VSS28) UD1.N4(VSS29) UD1.N9(VSS30) UD1.N11(VSS31) UD1.P1(VSS32) UD1.P3(VSS33) UD1.P10(VSS34) UD1.P12(VSS35) UD1.T1(VSS36) UD1.T3(VSS37) UD1.T5(VSS38) UD1.T8(VSS39) UD1.T10(VSS40) UD1.T12(VSS41) UD1.V1(VSS42) UD1.V5(VSS43) UD1.V8(VSS44) UD1.V12(VSS45) UD1.W2(VSS46) UD1.W4(VSS47) UD1.W9(VSS48) UD1.W11(VSS49) UD1.Y1(VSS50) UD1.Y5(VSS51) UD1.Y8(VSS52) UD1.Y12(VSS53) X1.2(GND) X1.4(GND) ; also on sheet 6 8 9 10 11 12 13
VBUS: C27.2 C28.2 U4.49(VBUS_1) U4.50(VBUS_2) ; also on sheet 6 8 11 12
VCC-LDO-RTC: C45.2 C92.2 R9.1 R10.1 U4.35(VRTC) U14.AE13(VCC-RTC)
VDD-CPUBFB: U5.1(DCDC2) U5.16(DCDC1) U14.R22(VDD-CPUBFB)
VDD-CPULFB: U4.12(FB1) U14.AA19(VDD-CPULFB)
VDD-DNRFB: U5.4(DCDC3) U14.AB13(VDD-DNRFB)
VDD-SYSFB: U4.34(FB2) U14.P18(VDD-SYSFB)
323-ALDO1: C69.1 U5.15(ALDO1)
323-DCDC1/2: C19.1 C20.1 C21.1 C22.1 C23.1 C24.1 C72.2 C74.2 C80.2 C81.2 L6.2 L7.2 U14.T19(VDD-CPUB0) U14.T21(VDD-CPUB1) U14.T22(VDD-CPUB2) U14.U18(VDD-CPUB3) U14.U19(VDD-CPUB4) U14.U21(VDD-CPUB5) U14.U22(VDD-CPUB6)
323-DCDC3: C83.1 C84.1 C85.1 C86.1 C87.2 C89.2 L8.2 U14.AA12(VDD-DNR2) U14.AA13(VDD-DNR3) U14.Y12(VDD-DNR0) U14.Y13(VDD-DNR1)
323-DLDO1: C71.1 U5.12(DLDO1)
323-RTCLDO: C73.1 U5.7(RTCLDO)
ADCIN0: C106.2 R26.2 U14.W9(ADCIN0)
ADCIN1: C107.2 R27.2 U14.W10(ADCIN1)
ALDO1: C51.1 U4.13(ALDO1)
ALDO2: C52.1 U4.14(ALDO2)
ALDO3: C53.1 C181.2 C182.2 C183.2 C184.2 R11.1 R12.1 U4.16(ALDO3) U14.AE11(VCC-PL) U14.AG9(VCC-PM)
ALDO4: C54.1 C90.2 C93.2 C108.2 C114.2 C132.1 C133.2 C161.1 C162.2 R19.2 R20.2 R24.2 R30.2 R31.2 R32.2 U4.17(ALDO4) U14.AB9(AVCC) U14.AD15(VCC-DCXO) U14.AD25(VDD18-DRAM) U14.AG15(VCC-PLL) U14.W7(VCC-ADC)
ALDO-OUT: C103.2 U14.AE7(ALDO-OUT)
AP-NMI: C94.2 R10.2 U4.37(IRQ) U5.11(IRQ) U14.AM10(NMI)
AP-RESET: C95.2 R9.2 R21.2 U4.1(PWROK) U5.13(PWROK) U14.AJ11(RESET)
AP-WAKE-BT: U14.U4(PG11/I2S1-BCLK/PG-EINT11) ; also on sheet 12
BLDO1: C59.1 C165.2 C166.2 C171.2 C172.2 C179.2 C180.2 U4.18(BLDO1) U14.N9(VCC-LVDS1) U14.N24(VCC-LVDS0) U14.T9(VCC-PG) ; also on sheet 12
BLDO2: C61.1 C134.1 C135.2 C136.2 C137.2 C138.2 C139.2 C140.2 C141.2 U4.19(BLDO2) U5.14(PWRON) UD1.F1(VDD1-0) UD1.F12(VDD1-1) UD1.G4(VDD1-2) UD1.G9(VDD1-3) UD1.T4(VDD1-4) UD1.T9(VDD1-5) UD1.U1(VDD1-6) UD1.U12(VDD1-7)
BLDO3: C63.1 C104.2 C185.2 C186.2 C187.2 C188.2 U4.21(BLDO3) U14.AJ5(CPVIN) U14.K13(VCC-MCSI) U14.M10(VCC-PK) ; also on sheet 6 13
BLDO4: C65.1 U4.22(BLDO4)
BOOT-SEL-ADC: R30.1 R33.2 U14.W1(GPADC0)
BT-RESETN: U14.U3(PG12/I2S1-LRCK/PG-EINT12) ; also on sheet 12
BT-WAKE-AP: U14.U5(PG10/I2S1-MCLK/PG-EINT10) ; also on sheet 12
CAN-RX0: U14.AJ17(PI16/UART3-CTS/TWI2-SDA/PWM-17/CAN-RX0/PI-EINT16) ; also on sheet 12
CAN-TX0: U14.AH17(PI15/UART3-RTS/TWI2-SCK/PWM-16/CAN-TX0/PI-EINT15) ; also on sheet 12
CLDO1: C60.2 C163.2 C164.2 U4.23(CLDO1) U14.U26(VCC-PC) ; also on sheet 8
CLDO2: C62.2 C91.2 U4.24(CLDO2) U14.R26(VCC-EFUSE)
CLDO3: C64.2 C102.2 C173.2 C174.2 U4.26(CLDO3) U14.AC9(VDD33) U14.L15(VCC-IO) ; also on sheet 6 8 9 12
CLDO4: C66.2 U4.27(CLDO4)
CPUSLDO: C13.1 C14.1 C35.2 U4.28(CPUSLDO) U14.AC15(VDD-CPUS)
CPUX-RX: U14.R29(PB10/UART0-RX/TWI0-SDA/PWM-1/I2S0-DIN3/I2S0-DOUT3/PB-EINT10) ; also on sheet 6 8
CPUX-TX: U14.R28(PB9/UART0-TX/TWI0-SCK/TRACE-DATA1/I2S0-DIN2/I2S0-DOUT2/PB-EINT9) ; also on sheet 6 8
CPVDD: C105.2 U14.AJ3(CPVDD)
CPVEE: C115.2 U14.AJ4(VEE) U14.AK2(CPVEE)
CTP-INT: U14.R31(PB12/TWI5-SDA/UART7-CTS/SPI1-CLK/PWM-3/PB-EINT12) ; also on sheet 8
CTP-RST: U14.R30(PB11/TWI5-SCK/UART7-RTS/SPI1-CS0/PWM-2/PB-EINT11) ; also on sheet 8
CTP-SCK: U14.R32(PB13/TWI4-SCK/UART7-TX/SPI1-MOSI/PWM-4/PB-EINT13) ; also on sheet 8
CTP-SDA: U14.R33(PB14/TWI4-SDA/UART7-RX/SPI1-MISO/PWM-5/PB-EINT14) ; also on sheet 8
DCDC1: C15.2 C16.2 C36.1 C37.1 C38.1 C39.1 C40.1 C41.1 C288.2 C289.2 L2.2 U14.W19(VDD-CPUL0) U14.W21(VDD-CPUL1) U14.Y19(VDD-CPUL2) U14.Y21(VDD-CPUL3)
DCDC2: C18.2 C25.2 C47.1 C48.1 C49.1 C50.1 C57.1 C58.1 C67.1 C68.1 C75.1 C76.1 C77.1 C78.1 C290.2 C291.2 L3.2 U14.N13(VDD-VE0) U14.N21(VDD-DE0) U14.P13(VDD-VE1) U14.P21(VDD-DE1) U14.P22(VDD-DE2) U14.R15(VDD-SYS0) U14.R17(VDD-SYS1) U14.R18(VDD-SYS2) U14.T11(VDD-GPU0) U14.T13(VDD-GPU1) U14.U12(VDD-GPU2) U14.U13(VDD-GPU3) ; also on sheet 6
DCDC3: C31.2 C33.2 C116.1 C117.1 C118.2 C119.2 C120.2 C121.2 C122.2 C123.2 C124.2 C125.2 C126.2 C127.2 C128.2 C129.2 C130.2 C131.2 C142.1 C143.1 C144.2 C145.2 C146.2 C147.1 C148.2 C149.2 C150.2 C151.2 C152.2 C153.2 C154.2 C155.2 C156.2 C157.2 C158.2 C159.2 C160.2 C292.2 C293.2 L4.2 R36.2 R37.2 R38.2 R39.2 R40.2 U4.29(FB3) U14.AA24(VCC-DRAM4) U14.AB24(VCC-DRAM5) U14.AC17(VCC-DRAML0) U14.AC18(VCC-DRAML1) U14.AC19(VCC-DRAML2) U14.AC20(VCC-DRAML3) U14.AC22(VCC-DRAML4) U14.AC24(VCC-DRAM6) U14.W23(VCC-DRAM0) U14.W24(VCC-DRAM1) U14.W25(VCC-DRAM2) U14.Y24(VCC-DRAM3) UD1.A4(VDD2-0) UD1.A9(VDD2-1) UD1.AA3(VDDQ-16) UD1.AA5(VDDQ-17) UD1.AA8(VDDQ-18) UD1.AA10(VDDQ-19) UD1.AB4(VDD2-22) UD1.AB9(VDD2-23) UD1.B3(VDDQ-0) UD1.B5(VDDQ-1) UD1.B8(VDDQ-2) UD1.B10(VDDQ-3) UD1.D1(VDDQ-4) UD1.D5(VDDQ-5) UD1.D8(VDDQ-6) UD1.D12(VDDQ-7) UD1.F3(VDDQ-8) UD1.F5(VDD2-2) UD1.F8(VDD2-3) UD1.F10(VDDQ-9) UD1.H1(VDD2-4) UD1.H5(VDD2-5) UD1.H8(VDD2-6) UD1.H12(VDD2-7) UD1.K1(VDD2-8) UD1.K3(VDD2-9) UD1.K10(VDD2-10) UD1.K12(VDD2-11) UD1.N1(VDD2-12) UD1.N3(VDD2-13) UD1.N10(VDD2-14) UD1.N12(VDD2-15) UD1.R1(VDD2-16) UD1.R5(VDD2-17) UD1.R8(VDD2-18) UD1.R12(VDD2-19) UD1.U3(VDDQ-10) UD1.U5(VDD2-20) UD1.U8(VDD2-21) UD1.U10(VDDQ-11) UD1.W1(VDDQ-12) UD1.W5(VDDQ-13) UD1.W8(VDDQ-14) UD1.W12(VDDQ-15)
DCDC4: C32.1 C34.1 C42.1 C167.2 C168.2 C169.2 C170.2 C175.2 C176.2 C177.2 C178.2 L5.1 R14.1 R17.2 U14.AE16(VCC-PI) U14.L9(VCC-PE) U14.L26(VCC-PD) U14.P9(VCC-PJ) ; also on sheet 6 8 9 10 12 13
DCXO-XIN: C99.2 U14.AM13(DXIN) X1.1(OSC1)
DCXO-XOUT: C98.2 U14.AN13(DXOUT) X1.3(OSC2)
DDR-PARA-SEL-ADC1: R31.1 R34.2 U14.W2(GPADC1)
DDR-PARA-SEL-ADC2: R32.1 R35.2 U14.W3(GPADC2)
DSP-UART-RX: U14.AN2(PM1/S-UART0-RX/S-UART1-RX/S-PWM-3/S-PM-EINT1) ; also on sheet 8
DSP-UART-TX: U14.AN3(PM0/S-UART0-TX/S-UART1-TX/S-PWM-2/S-PM-EINT0) ; also on sheet 8
FEL: C96.2 R22.2 U14.F16(FEL)
HBIAS: U14.AL1(HBIAS) ; also on sheet 12
HP-DET: U14.AJ2(HP-DET) ; also on sheet 12
HPOUTFB: U14.AM1(HPOUTFB) ; also on sheet 12
HPOUTL: U14.AL2(HPOUTL) ; also on sheet 12
HPOUTR: U14.AM2(HPOUTR) ; also on sheet 12
IR-RX: U14.AL16(PI8/TWI5-SCK/IR-RX/PWM-9/SPI2-MOSI/PI-EINT8) ; also on sheet 12
LCD0-CLK: U14.K31(PD18/LCD0-CLK/LVDS1-D3P/DSI1-D3P/PWM-18/UART4-TX/PD-EINT18) ; also on sheet 8
LCD0-D0: U14.N28(PB0/UART2-TX/SPI2-CS0/JTAG-MS/LCD0-D0/PWM-6/PB-EINT0) ; also on sheet 8
LCD0-D1: U14.N29(PB1/UART2-RX/SPI2-CLK/JTAG-CK/LCD0-D1/PWM-7/PB-EINT1) ; also on sheet 8
LCD0-D2: U14.D32(PD0/LCD0-D2/LVDS0-D0P/DSI0-D0P/PWM-0/PD-EINT0) ; also on sheet 8
LCD0-D3: U14.D33(PD1/LCD0-D3/LVDS0-D0N/DSI0-D0N/PWM-1/PD-EINT1) ; also on sheet 8
LCD0-D4: U14.E30(PD2/LCD0-D4/LVDS0-D1P/DSI0-D1P/PWM-2/PD-EINT2) ; also on sheet 8
LCD0-D5: U14.E31(PD3/LCD0-D5/LVDS0-D1N/DSI0-D1N/PWM-3/PD-EINT3) ; also on sheet 8
LCD0-D6: U14.E32(PD4/LCD0-D6/LVDS0-D2P/DSI0-CKP/PWM-4/PD-EINT4) ; also on sheet 8
LCD0-D7: U14.E33(PD5/LCD0-D7/LVDS0-D2N/DSI0-CKN/PWM-5/PD-EINT5) ; also on sheet 8
LCD0-D8: U14.M31(PB2/UART2-RTS/SPI2-MOSI/JTAG-DO/LCD0-D8/CAN-TX0/PB-EINT2) ; also on sheet 8
LCD0-D9: U14.M32(PB3/UART2-CTS/SPI2-MISO/JTAG-DI/LCD0-D9/CAN-RX0/PB-EINT3) ; also on sheet 8
LCD0-D10: U14.F32(PD6/LCD0-D10/LVDS0-CKP/DSI0-D2P/PWM-6/PD-EINT6) ; also on sheet 8
LCD0-D11: U14.F33(PD7/LCD0-D11/LVDS0-CKN/DSI0-D2N/PWM-7/PD-EINT7) ; also on sheet 8
LCD0-D12: U14.G30(PD8/LCD0-D12/LVDS0-D3P/DSI0-D3P/PWM-8/PD-EINT8) ; also on sheet 8
LCD0-D13: U14.G31(PD9/LCD0-D13/LVDS0-D3N/DSI0-D3N/PWM-9/PD-EINT9) ; also on sheet 8
LCD0-D14: U14.G32(PD10/LCD0-D14/LVDS1-D0P/DSI1-D0P/PWM-10/SPI1-CS0/DBI-CSX/PD-EINT10) ; also on sheet 8
LCD0-D15: U14.G33(PD11/LCD0-D15/LVDS1-D0N/DSI1-D0N/PWM-11/SPI1-CLK/DBI-SCLK/PD-EINT11) ; also on sheet 8
LCD0-D16: U14.P31(PB7/OWA-IN/I2S0-DOUT0/I2S0-DIN1/LCD0-D16/PWM-11/PB-EINT7) ; also on sheet 8
LCD0-D17: U14.P32(PB8/OWA-OUT/I2S0-DIN0/I2S0-DOUT1/LCD0-D17/PWM-0/PB-EINT8) ; also on sheet 8
LCD0-D18: U14.H31(PD12/LCD0-D18/LVDS1-D1P/DSI1-D1P/PWM-12/SPI1-MOSI/DBI-SDO/PD-EINT12) ; also on sheet 8
LCD0-D19: U14.H32(PD13/LCD0-D19/LVDS1-D1N/DSI1-D1N/PWM-13/SPI1-MISO/DBI-SDI/DBI-TE/DBI-DCX/PD-EINT13) ; also on sheet 8
LCD0-D20: U14.J29(PD14/LCD0-D20/LVDS1-D2P/DSI1-CKP/PWM-14/UART3-TX/PD-EINT14) ; also on sheet 8
LCD0-D21: U14.J30(PD15/LCD0-D21/LVDS1-D2N/DSI1-CKN/PWM-15/UART3-RX/PD-EINT15) ; also on sheet 8
LCD0-D22: U14.J32(PD16/LCD0-D22/LVDS1-CKP/DSI1-D2P/PWM-16/UART3-RTS/PD-EINT16) ; also on sheet 8
LCD0-D23: U14.J33(PD17/LCD0-D23/LVDS1-CKN/DSI1-D2N/PWM-17/UART3-CTS/PD-EINT17) ; also on sheet 8
LCD0-DE: U14.K32(PD19/LCD0-DE/LVDS1-D3N/DSI1-D3N/PWM-19/UART4-RX/PD-EINT19) ; also on sheet 8
LCD0-HSYNC: U14.L28(PD20/LCD0-HSYNC/PWM-2/UART2-TX/UART7-RTS/UART4-RTS/PD-EINT20) ; also on sheet 8
LCD0-PWM: U14.L31(PD22/PWM-1/SPI1-HOLD/DBI-DCX/DBI-WRX/UART2-RTS/UART7-TX/TWI0-SCK/PD-EINT22) ; also on sheet 8
LCD0-RST: U14.L32(PD23/PWM-0/SPI1-WP/DBI-TE/UART2-CTS/UART7-RX/TWI0-SDA/PD-EINT23) ; also on sheet 8
LCD0-VSYNC: U14.L29(PD21/LCD0-VSYNC/PWM-3/UART2-RX/UART7-CTS/UART4-CTS/PD-EINT21) ; also on sheet 8
LEDC: U14.C13(PH19/IR-RX/I2S3-DOUT3/I2S3-DIN3/LEDC/PCIE0-CLKREQN/PH-EINT19) ; also on sheet 8
MCSI0-CKN: U14.A10(PK4/MCSIA-CKN/TWI2-SCK/PK-EINT4) ; also on sheet 13
MCSI0-CKP: U14.B10(PK5/MCSIA-CKP/TWI2-SDA/PK-EINT5) ; also on sheet 13
MCSI0-D0N: U14.A12(PK0/MCSIA-D0N/PK-EINT0) ; also on sheet 13
MCSI0-D0P: U14.B12(PK1/MCSIA-D0P/PK-EINT1) ; also on sheet 13
MCSI0-D1N: U14.B11(PK2/MCSIA-D1N/PK-EINT2) ; also on sheet 13
MCSI0-D1P: U14.C11(PK3/MCSIA-D1P/PK-EINT3) ; also on sheet 13
MCSI0-D2N: U14.E12(PK6/MCSIB-D0N/PK-EINT6) ; also on sheet 13
MCSI0-D2P: U14.D12(PK7/MCSIB-D0P/PK-EINT7) ; also on sheet 13
MCSI0-D3N: U14.E10(PK8/MCSIB-D1N/PK-EINT8) ; also on sheet 13
MCSI0-D3P: U14.D10(PK9/MCSIB-D1P/PK-EINT9) ; also on sheet 13
MCSI0-MCLK: U14.A6(PK18/MCSID-D0N/MCSI0-MCLK/UART6-TX/NCSI-D2/PK-EINT18) ; also on sheet 13
MCSI0-PWDN: U14.B4(PK23/MCSID-CKP/TWI3-SDA/PWM-7/NCSI-D7/PK-EINT23) ; also on sheet 13
MCSI0-RSTN: U14.A4(PK22/MCSID-CKN/TWI3-SCK/PWM-6/NCSI-D6/PK-EINT22) ; also on sheet 13
MCSI0-SCK: U14.E8(PK10/MCSIB-CKN/TWI3-SCK/PK-EINT10) ; also on sheet 13
MCSI0-SDA: U14.D8(PK11/MCSIB-CKP/TWI3-SDA/PK-EINT11) ; also on sheet 13
MCSI0-USER: U14.B5(PK21/MCSID-D1P/MCSI1-MCLK/UART6-CTS/NCSI-D5/PK-EINT21) ; also on sheet 13
MICIN3N: U14.AF1(MICIN3N) ; also on sheet 12
MICIN3P: U14.AF2(MICIN3P) ; also on sheet 12
PE0: U14.E6(PE0/MCSI0-MCLK/PE-EINT0) ; also on sheet 8
PE1: U14.C4(PE1/TWI2-SCK/UART4-TX/PE-EINT1) ; also on sheet 8
PE2: U14.E5(PE2/TWI2-SDA/UART4-RX/PE-EINT2) ; also on sheet 8
PE3: U14.E4(PE3/TWI3-SCK/UART4-RTS/PE-EINT3) ; also on sheet 8
PE4: U14.C3(PE4/TWI3-SDA/UART4-CTS/PE-EINT4) ; also on sheet 8
PE5: U14.B3(PE5/MCSI1-MCLK/PLL-LOCK-DBG/I2S2-MCLK/LEDC/PE-EINT5) ; also on sheet 8
PE6: U14.A3(PE6/I2S2-BCLK/LCD0-TRIG/NCSI-D8/PE-EINT6) ; also on sheet 8
PE7: U14.A2(PE7/I2S2-LRCK/LCD1-TRIG/NCSI-D9/PE-EINT7) ; also on sheet 8
PE8: U14.B2(PE8/I2S2-DOUT0/LCD2-TRIG/NCSI-D10/PE-EINT8) ; also on sheet 8
PE9: U14.B1(PE9/I2S2-DIN0/NCSI-D11/PE-EINT9) ; also on sheet 8
PE10: U14.C2(PE10/MCSI3-MCLK/PWM-3/NCSI-D12/PE-EINT10) ; also on sheet 8
PE11: U14.J7(PE11/TWI1-SCK/UART5-RTS/SPI2-CS0/UART6-TX/NCSI-D13/PE-EINT11) ; also on sheet 8
PE12: U14.C1(PE12/TWI1-SDA/UART5-CTS/SPI2-CLK/UART6-RX/NCSI-D14/PE-EINT12) ; also on sheet 8
PE13: U14.G6(PE13/TWI4-SCK/UART5-TX/SPI2-MOSI/UART6-RTS/CSI0-XVS-FSYNC/PE-EINT13) ; also on sheet 8
PE14: U14.L7(PE14/TWI4-SDA/UART5-RX/SPI2-MISO/UART6-CTS/CSI1-XVS-FSYNC/PE-EINT14) ; also on sheet 8
PE15: U14.N7(PE15/MCSI2-MCLK/PWM-2/NCSI-D15/PE-EINT15) ; also on sheet 8
PGAOUT0: R26.1 U14.U8(PGAOUT0)
PGAOUT1: R27.1 U14.U10(PGAOUT1)
PHYRSTB0: U14.D16(PH8/DMIC-CLK/SPI2-CS0/I2S2-MCLK/I2S2-DIN2/PH-EINT8) ; also on sheet 9
PHYRSTB1: U14.J1(PJ16/LCD1-D16/LVDS3-CKP/PJ-EINT16) ; also on sheet 10
PMU-SCK: R11.2 U4.52(SCK) U5.6(SCL) U14.AN6(PL0/S-TWI0-SCK/S-PL-EINT0)
PMU-SDA: R12.2 U4.51(SDA) U5.5(SDA) U14.AN5(PL1/S-TWI0-SDA/S-PL-EINT1)
PS: C12.1 C17.1 C26.1 C29.1 C30.1 C46.1 C55.1 C56.2 C70.2 C79.2 C82.2 C283.2 C284.2 C285.2 C286.2 C287.2 U4.9(VIN1) U4.15(ALDOIN) U4.20(BLDOIN) U4.25(CLDOIN) U4.31(VIN3) U4.32(VIN2) U4.43(VSYS_1) U4.44(VSYS_2) U4.47(VMID_1) U4.48(VMID_2) U5.2(VIN3) U5.17(VIN1) U5.20(VIN2)
PWRON: C11.1 C97.2 R23.2 U4.6(PWRON)
RGMII0-CLKIN: U14.C17(PH3/TWI1-SDA/IR-TX/I2S2-DIN2/RGMII0-CLKIN/RMII0-RXER/I2S2-DOUT2/PH-EINT3) ; also on sheet 9
RGMII0-MDC: U14.C16(PH9/DMIC-DATA0/SPI2-CLK/I2S2-BCLK/RGMII0-MDC/PH-EINT9) ; also on sheet 9
RGMII0-MDIO: U14.B16(PH10/DMIC-DATA1/SPI2-MOSI/I2S2-LRCK/RGMII0-MDIO/PH-EINT10) ; also on sheet 9
RGMII0-RXCK: U14.B14(PH16/I2S3-DOUT0/I2S3-DIN1/RGMII0-RXCK/RMII0-NULL/CLK-FANOUT0/PH-EINT16) ; also on sheet 9
RGMII0-RXCTL: U14.D18(PH2/TWI1-SCK/CPU-CUR-W/I2S2-DIN3/RGMII0-RXCTL/RMII0-CRS-DV/I2S2-DOUT3/PH-EINT2) ; also on sheet 9
RGMII0-RXD0: U14.E18(PH1/TWI0-SDA/RGMII0-RXD0/RMII0-RXD0/PH-EINT1) ; also on sheet 9
RGMII0-RXD1: U14.F18(PH0/TWI0-SCK/RGMII0-RXD1/RMII0-RXD1/PH-EINT0) ; also on sheet 9
RGMII0-RXD2: U14.D14(PH15/I2S3-LRCK/RGMII0-RXD2/RMII0-NULL/PH-EINT15) ; also on sheet 9
RGMII0-RXD3: U14.E14(PH14/I2S3-BCLK/RGMII0-RXD3/RMII0-NULL/PH-EINT14) ; also on sheet 9
RGMII0-TXCK: U14.G12(PH6/UART3-RTS/SPI1-MOSI/OWA-IN/RGMII0-TXCK/RMII0-TXCK/PH-EINT6) ; also on sheet 9
RGMII0-TXCTL: U14.F14(PH7/UART3-CTS/SPI1-MISO/OWA-OUT/RGMII0-TXCTL/RMII0-TXEN/PH-EINT7) ; also on sheet 9
RGMII0-TXD0: U14.E16(PH5/UART3-RX/SPI1-CLK/LEDC/RGMII0-TXD0/RMII0-TXD0/PH-EINT5) ; also on sheet 9
RGMII0-TXD1: U14.B17(PH4/UART3-TX/SPI1-CS0/CPU-CUR-W/RGMII0-TXD1/RMII0-TXD1/PH-EINT4) ; also on sheet 9
RGMII0-TXD2: U14.A14(PH18/IR-TX/I2S3-DOUT2/I2S3-DIN2/RGMII0-TXD2/RMII0-NULL/PH-EINT18) ; also on sheet 9
RGMII0-TXD3: U14.B13(PH17/I2S3-DOUT1/I2S3-DIN0/RGMII0-TXD3/RMII0-NULL/PH-EINT17) ; also on sheet 9
RGMII1-CLKIN: U14.E2(PJ3/LCD1-D3/LVDS2-D1N/RGMII1-CLKIN/RMII1-RXER/PJ-EINT3) ; also on sheet 10
RGMII1-MDC: U14.H2(PJ8/LCD1-D8/LVDS2-D3P/RGMII1-MDC/PJ-EINT8) ; also on sheet 10
RGMII1-MDIO: U14.H3(PJ9/LCD1-D9/LVDS2-D3N/RGMII1-MDIO/PJ-EINT9) ; also on sheet 10
RGMII1-RXCK: U14.J5(PJ13/LCD1-D13/LVDS3-D1N/RGMII1-RXCK/RMII1-NULL/PJ-EINT13) ; also on sheet 10
RGMII1-RXCTL: U14.E1(PJ2/LCD1-D2/LVDS2-D1P/RGMII1-RXCTL/RMII1-CRS-DV/PJ-EINT2) ; also on sheet 10
RGMII1-RXD0: U14.D2(PJ1/LCD1-D1/LVDS2-D0N/RGMII1-RXD0/RMII1-RXD0/PJ-EINT1) ; also on sheet 10
RGMII1-RXD1: U14.D1(PJ0/LCD1-D0/LVDS2-D0P/RGMII1-RXD1/RMII1-RXD1/PJ-EINT0) ; also on sheet 10
RGMII1-RXD2: U14.J4(PJ12/LCD1-D12/LVDS3-D1P/RGMII1-RXD2/RMII1-NULL/PJ-EINT12) ; also on sheet 10
RGMII1-RXD3: U14.G5(PJ11/LCD1-D11/LVDS3-D0N/RGMII1-RXD3/RMII1-NULL/PJ-EINT11) ; also on sheet 10
RGMII1-TXCK: U14.G1(PJ6/LCD1-D6/LVDS2-CKP/RGMII1-TXCK/RMII1-TXCK/PJ-EINT6) ; also on sheet 10
RGMII1-TXCTL: U14.G2(PJ7/LCD1-D7/LVDS2-CKN/RGMII1-TXCTL/RMII1-TXEN/PJ-EINT7) ; also on sheet 10
RGMII1-TXD0: U14.F2(PJ5/LCD1-D5/LVDS2-D2N/RGMII1-TXD0/RMII1-TXD0/PJ-EINT5) ; also on sheet 10
RGMII1-TXD1: U14.F1(PJ4/LCD1-D4/LVDS2-D2P/RGMII1-TXD1/RMII1-TXD1/PJ-EINT4) ; also on sheet 10
RGMII1-TXD2: U14.L5(PJ15/LCD1-D15/LVDS3-D2N/RGMII1-TXD2/RMII1-NULL/PJ-EINT15) ; also on sheet 10
RGMII1-TXD3: U14.L4(PJ14/LCD1-D14/LVDS3-D2P/RGMII1-TXD3/RMII1-NULL/PJ-EINT14) ; also on sheet 10
SAA0: U14.AJ33(SA2) UD1.H2(CA0_A)
SAA1: U14.AJ32(SA11) UD1.J2(CA1_A)
SAA2: U14.AG30(SA1) UD1.H9(CA2_A)
SAA3: U14.AG29(SA10) UD1.H10(CA3_A)
SAA4: U14.AJ30(SA17) UD1.H11(CA4_A)
SAA5: U14.AJ31(SA9) UD1.J11(CA5_A)
SAB0: U14.AJ25(SBA1) UD1.R2(CA0_B)
SAB1: U14.AH25(SA4) UD1.P2(CA1_B)
SAB2: U14.AL25(SA8) UD1.R9(CA2_B)
SAB3: U14.AK25(SBA0) UD1.R10(CA3_B)
SAB4: U14.AJ27(SA16) UD1.R11(CA4_B)
SAB5: U14.AL29(SACT) UD1.P11(CA5_B)
SCKE0-A: U14.AM31(SCKE0) UD1.J4(CKE0_A)
SCKE0-B: U14.AN27(SA6) UD1.P4(CKE0_B)
SCKE1-A: U14.AL31(SA12) UD1.J5(CKE1_A)
SCKE1-B: U14.AM27(SBG1) UD1.P5(CKE1_B)
SCKN-A: U14.AN30(SCKN) UD1.J9(CK_C_A)
SCKN-B: U14.AN29(SA15) UD1.P9(CK_C_B)
SCKP-A: U14.AM30(SCKP) UD1.J8(CK_T_A)
SCKP-B: U14.AM28(SA14) UD1.P8(CK_T_B)
SCS0-A: U14.AN32(SCS0) UD1.H4(CS0_A)
SCS0-B: U14.AK29(SA13) UD1.R4(CS0_B)
SCS1-A: U14.AM32(SCS1) UD1.H3(CS1_A)
SCS1-B: U14.AK27(SA5) UD1.R3(CS1_B)
SDC0-CLK: R42.2 ; also on sheet 8
SDC0-CMD: U14.B19(PF3/SDC0-CMD/JTAG-DO/TRACE-DATA0/I2S3-LRCK/PF-EINT3) ; also on sheet 8
SDC0-D0: U14.A20(PF1/SDC0-D0/JTAG-DI/TRACE-DATA1/I2S3-DOUT0/I2S3-DIN1/PF-EINT1) ; also on sheet 8
SDC0-D1: U14.B20(PF0/SDC0-D1/JTAG-MS/TRACE-DATA2/I2S3-DIN0/I2S3-DOUT1/PF-EINT0) ; also on sheet 8
SDC0-D2: U14.A18(PF5/SDC0-D2/JTAG-CK/TRACE-CLK/I2S3-BCLK/PF-EINT5) ; also on sheet 8
SDC0-D3: U14.B18(PF4/SDC0-D3/UART0-RX/I2S3-DIN3/I2S3-DOUT3/PF-EINT4) ; also on sheet 8
SDC0-DET: U14.D20(PF6/I2S3-MCLK/PF-EINT6) ; also on sheet 8
SDC1-CLK: R43.2 ; also on sheet 12
SDC1-CMD: U14.R2(PG1/SDC1-CMD/PG-EINT1) ; also on sheet 12
SDC1-D0: U14.P3(PG2/SDC1-D0/PCIE0-PERSTN/PG-EINT2) ; also on sheet 12
SDC1-D1: U14.P2(PG3/SDC1-D1/PCIE0-WAKEN/PG-EINT3) ; also on sheet 12
SDC1-D2: U14.T3(PG4/SDC1-D2/PCIE0-CLKREQN/PG-EINT4) ; also on sheet 12
SDC1-D3: U14.T2(PG5/SDC1-D3/PG-EINT5) ; also on sheet 12
SDC2-CLK: R41.1 ; also on sheet 8
SDC2-CMD: U14.W33(PC6/NAND-RB0/SDC2-CMD/PC-EINT6) ; also on sheet 8
SDC2-D0: U14.V32(PC10/NAND-DQ5/SDC2-D0/SPIF-D5/PC-EINT10) ; also on sheet 8
SDC2-D1: U14.U32(PC13/NAND-DQ3/SDC2-D1/PC-EINT13) ; also on sheet 8
SDC2-D2: U14.T32(PC15/NAND-DQ1/SDC2-D2/SPI0-WP/SPIF-WP/PC-EINT15) ; also on sheet 8
SDC2-D3: U14.W32(PC8/NAND-DQ7/SDC2-D3/SPIF-D7/PC-EINT8) ; also on sheet 8
SDC2-D4: U14.W31(PC9/NAND-DQ6/SDC2-D4/SPIF-D6/PC-EINT9) ; also on sheet 8
SDC2-D5: U14.V31(PC11/NAND-DQ4/SDC2-D5/SPIF-D4/PC-EINT11) ; also on sheet 8
SDC2-D6: U14.U31(PC14/NAND-DQ2/SDC2-D6/PC-EINT14) ; also on sheet 8
SDC2-D7: U14.T31(PC16/NAND-DQ0/SDC2-D7/SPI0-HOLD/SPIF-HOLD/PC-EINT16) ; also on sheet 8
SDC2-DS: U14.W28(PC0/NAND-WE/SDC2-DS/PC-EINT0) ; also on sheet 8
SDC2-RST: U14.Y31(PC1/NAND-ALE/SDC2-RST/PC-EINT1) ; also on sheet 8
SDQ0: U14.AE28(SDQ0) UD1.E4(DQ5_A)
SDQ1: U14.AE27(SDQ1) UD1.F4(DQ4_A)
SDQ2: U14.AG32(SDQ2) UD1.E2(DQ2_A)
SDQ3: U14.AH33(SDQ3) UD1.F2(DQ3_A)
SDQ4: U14.AE30(SDQ4) UD1.B2(DQ0_A)
SDQ5: U14.AD32(SDQ5) UD1.B4(DQ7_A)
SDQ6: U14.AE31(SDQ6) UD1.C2(DQ1_A)
SDQ7: U14.AD33(SDQ7) UD1.C4(DQ6_A)
SDQ8: U14.AC27(SDQ8) UD1.E9(DQ13_A)
SDQ9: U14.AC28(SDQ9) UD1.F9(DQ12_A)
SDQ10: U14.AC30(SDQ10) UD1.B9(DQ15_A)
SDQ11: U14.AC31(SDQ11) UD1.C9(DQ14_A)
SDQ12: U14.AA33(SDQ12) UD1.C11(DQ9_A)
SDQ13: U14.AA31(SDQ13) UD1.B11(DQ8_A)
SDQ14: U14.AA28(SDQ14) UD1.F11(DQ11_A)
SDQ15: U14.AA27(SDQ15) UD1.E11(DQ10_A)
SDQ16: U14.AM25(SDQ16) UD1.U2(DQ3_B)
SDQ17: U14.AN25(SDQ17) UD1.V2(DQ2_B)
SDQ18: U14.AH23(SDQ18) UD1.U4(DQ4_B)
SDQ19: U14.AK23(SDQ19) UD1.Y2(DQ1_B)
SDQ20: U14.AL23(SDQ20) UD1.V4(DQ5_B)
SDQ21: U14.AM22(SDQ21) UD1.AA2(DQ0_B)
SDQ22: U14.AN21(SDQ22) UD1.AA4(DQ7_B)
SDQ23: U14.AG21(SDQ23) UD1.Y4(DQ6_B)
SDQ24: U14.AG19(SDQ24) UD1.AA9(DQ15_B)
SDQ25: U14.AH19(SDQ25) UD1.AA11(DQ8_B)
SDQ26: U14.AK19(SDQ26) UD1.V11(DQ10_B)
SDQ27: U14.AL19(SDQ27) UD1.Y11(DQ9_B)
SDQ28: U14.AM21(SDQ28) UD1.U9(DQ12_B)
SDQ29: U14.AL21(SDQ29) UD1.U11(DQ11_B)
SDQ30: U14.AK21(SDQ30) UD1.Y9(DQ14_B)
SDQ31: U14.AH21(SDQ31) UD1.V9(DQ13_B)
SDQM0: U14.AE33(SDQM0) UD1.C3(DM0_A)
SDQM1: U14.AC32(SDQM1) UD1.C10(DM1_A)
SDQM2: U14.AM24(SDQM2) UD1.Y3(DM0_B)
SDQM3: U14.AN20(SDQM3) UD1.Y10(DM1_B)
SDQS0N: U14.AF33(SDQS0N) UD1.E3(DQS0N_A)
SDQS0P: U14.AF32(SDQS0P) UD1.D3(DQS0P_A)
SDQS1N: U14.AB33(SDQS1N) UD1.E10(DQS1N_A)
SDQS1P: U14.AB32(SDQS1P) UD1.D10(DQS1P_A)
SDQS2N: U14.AN23(SDQS2N) UD1.V3(DQS0N_B)
SDQS2P: U14.AM23(SDQS2P) UD1.W3(DQS0P_B)
SDQS3N: U14.AN19(SDQS3N) UD1.V10(DQS1N_B)
SDQS3P: U14.AM19(SDQS3P) UD1.W10(DQS1P_B)
SPI0-CLK: R123.1 ; also on sheet 12
SPI0-CS: U14.K3(PJ20/LCD1-D20/UART2-TX/UART3-RTS/SPI0-CS0/PJ-EINT20) ; also on sheet 12
SPI0-HOLD: U14.N2(PJ26/LCD1-HSYNC/TWI5-SCK/UART4-RTS/SPI0-HOLD/PJ-EINT26) ; also on sheet 12
SPI0-MISO: U14.L1(PJ23/LCD1-D23/UART2-CTS/UART3-RX/SPI0-MISO/PJ-EINT23) ; also on sheet 12
SPI0-MOSI: U14.L2(PJ22/LCD1-D22/UART2-RTS/UART3-TX/SPI0-MOSI/PJ-EINT22) ; also on sheet 12
SPI0-WP: U14.M2(PJ25/LCD1-DE/TWI4-SDA/UART4-RX/SPI0-WP/PJ-EINT25) ; also on sheet 12
SPI-LCD-BLK: U14.AN9(PL8/S-TWI1-SCK/S-DJTAG-MS/S-RJTAG-MS/I2S0-MCLK/DMIC-DATA0/S-PL-EINT8) ; also on sheet 8
SPI-LCD-CLK: U14.AJ9(PL11/S-IR-RX/S-DJTAG-DI/S-RJTAG-DI/DMIC-DATA1/S-SPI0-CLK/S-PL-EINT11) ; also on sheet 8
SPI-LCD-CS: U14.AK9(PL10/S-PWM-0/S-DJTAG-DO/S-RJTAG-DO/DMIC-DATA0/S-SPI0-CS0/S-PL-EINT10) ; also on sheet 8
SPI-LCD-DC: U14.AJ7(PL13/S-TWI2-SDA/S-PWM-9/S-UART0-RX/DMIC-DATA3/S-SPI0-MISO/S-PL-EINT13) ; also on sheet 8
SPI-LCD-MOSI: U14.AK7(PL12/S-TWI2-SCK/S-PWM-8/S-UART0-TX/DMIC-DATA2/S-SPI0-MOSI/S-PL-EINT12) ; also on sheet 8
SPI-LCD-RST: U14.AM9(PL9/S-TWI1-SDA/S-DJTAG-CK/S-RJTAG-CK/S-PWM-1/DMIC-CLK/S-PL-EINT9) ; also on sheet 8
SRST: U14.AG23(SRST) UD1.T11(RESET-N)
STWI1-SCK: U14.AM4(PM2/S-TWI1-SCK/S-RJTAG-MS/S-PWM-6/S-PM-EINT2) ; also on sheet 8
STWI1-SDA: U14.AM3(PM3/S-TWI1-SDA/S-RJTAG-CK/S-PWM-7/S-PM-EINT3) ; also on sheet 8
UART1-CTS: U14.U6(PG9/UART1-CTS/PG-EINT9) ; also on sheet 12
UART1-RTS: U14.R4(PG8/UART1-RTS/PG-EINT8) ; also on sheet 12
UART1-RX: U14.R5(PG7/UART1-RX/PG-EINT7) ; also on sheet 12
UART1-TX: U14.R6(PG6/UART1-TX/PG-EINT6) ; also on sheet 12
USB0-DRVVBUS: U14.AL17(PI12/UART3-RX/PWM-13/SPI2-MISO/PI-EINT12) ; also on sheet 6
USB0-VBUSDET: U14.AK17(PI13/UART6-CTS/DMIC-DATA3/PWM-14/I2S2-MCLK/PI-EINT13) ; also on sheet 6
VCM-ADC: C112.2 U14.Y9(VCM-ADC)
VRA1: C109.2 U14.AG5(VRA1)
VRA2: C110.2 U14.AG4(VRA2)
VREFP-ADC: C113.2 R24.1 U14.AA9(VREFP-ADC)
VRP: C111.2 U14.AC7(VRP)
WL-REG-ON: U14.U2(PG13/I2S1-DOUT0/I2S1-DIN1/PG-EINT13) ; also on sheet 12
WL-WAKE-AP: U14.U1(PG14/I2S1-DIN0/I2S1-DOUT1/PG-EINT14) ; also on sheet 12
X32KIN: C100.2 R25.1 U14.AM12(X32KIN) X2.1
X32KOUT: C101.2 R25.2 U14.AM11(X32KOUT) X2.2
$1N3706: L2.1 U4.10(LX1_1) U4.11(LX1_2)
$1N3718: L3.1 U4.33(LX2)
$1N3723: L4.1 U4.30(LX3)
$1N3725: C43.1 U4.7(VREF)
$1N4703: R13.2 U4.39(TS)
$1N4773: C44.2 U4.41(BAT_1) U4.42(BAT_2)
$1N4806: R14.2 U4.38(CHGLED)
$1N4992: L5.2 U4.45(SW_1) U4.46(SW_2)
$1N6251: L6.1 U5.18(LX1)
$1N6517: L7.1 U5.19(LX2)
$1N6728: L8.1 U5.3(LX3)
$1N7320: C88.1 U5.8(VREF)
$1N42597: LED1.1(A) R17.1
$2N1846: R21.1 RESET1.3
$2N2360: R19.1 U14.V3(LRADC0)
$2N2431: R20.1 U14.V2(LRADC1)
$2N32401: FEL1.3 R22.1
$2N32457: PWR1.3 R23.1
$3N7591: R38.1 U14.AA29(SZQ)
$3N7643: R39.1 UD1.A5(ZQ0)
$3N7644: R40.1 UD1.A8(ZQ1)
$3N7648: R36.1 UD1.G2(ODT_CA_A)
$3N7649: R37.1 UD1.T2(ODT_CA_B)
$4N500: R41.2 U14.Y32(PC5/NAND-RE/SDC2-CLK/PC-EINT5)
$4N609: R42.1 U14.C19(PF2/SDC0-CLK/UART0-TX/I2S3-DIN2/I2S3-DOUT2/PF-EINT2)
$4N713: R43.1 U14.R1(PG0/SDC1-CLK/PG-EINT0)
$5N3909: R123.2 U14.K2(PJ21/LCD1-D21/UART2-RX/UART3-CTS/SPI0-CLK/PJ-EINT21)

Not connected (* = marked no-connect by the designer): FEL1 2* 4*; PWR1 2* 4*; RESET1 2* 4*; U4 2(DM)* 3(DP)* 4(CC1)* 5(CC2)* 36(BACKUP)* 40(DCDCEN)*; U5 10(NC)*; U14 A5(PK20/MCSID-D1N/TWI2-SDA/UART6-RTS/NCSI-D4/PK-EINT20)* A8(PK14/MCSIC-D1N/UART7-RTS/UART5-RTS/NCSI-HSYNC/PK-EINT14)* A16(PH11/DMIC-DATA2/SPI2-MISO/I2S2-DOUT0/I2S2-DIN1/PCIE0-PERSTN/PH-EINT11)* AA1(GPADC8)* AA2(GPADC9)* AA3(GPADC10)* AA4(GPADC11)* AA5(GPADC12)* AA6(GPADC13)* AB2(GPADC14)* AB3(GPADC15)* AC2(GPADC16)* AC3(GPADC17)* AC4(GPADC18)* AC5(GPADC19)* AC6(GPADC20)* AD1(MICIN1N)* AD2(MICIN1P)* AE1(MICIN2N)* AE2(MICIN2P)* AE4(GPADC21)* AE5(GPADC22)* AE6(GPADC23)* AG1(LINEOUTLN)* AG2(LINEOUTLP)* AG13(PI1/TWI4-SDA/UART4-RX/PWM-2/I2S2-DIN2/I2S2-DOUT2/PI-EINT1)* AG17(PLLTEST)* AH1(LINEOUTRN)* AH2(LINEOUTRP)* AH11(TEST)* AH13(PI0/TWI4-SCK/UART4-TX/PWM-1/I2S2-DIN3/I2S2-DOUT3/PI-EINT0)* AH15(PI7/UART6-RX/UART4-CTS/PWM-8/SPI2-CLK/PI-EINT7)* AJ1(MIC-DET)* AJ15(PI5/UART5-CTS/SPI1-MISO/PWM-6/I2S2-DIN0/I2S2-DOUT1/PI-EINT5)* AK1(MBIAS)* AK13(WREQIN)* AK15(PI6/UART6-TX/UART4-RTS/PWM-7/SPI2-CS0/PI-EINT6)* AK33(SA0)* AL5(PM5/S-IR-RX/S-RJTAG-DI/S-TWI2-SDA/S-PWM-9/S-PM-EINT5)* AL7(PL5/S-JTAG-CK/S-CAN-RX0/S-PWM-5/I2S0-LRCK/DMIC-DATA3/S-PL-EINT5)* AL11(X32KFOUT)* AL15(PI2/UART5-TX/SPI1-CS0/PWM-3/I2S2-BCLK/PI-EINT2)* AL27(SA3)* AL32(SODT0)* AL33(SODT1)* AM6(PL3/S-UART0-RX/S-UART1-RX/S-PWM-3/S-PL-EINT3)* AM7(PL4/S-JTAG-MS/S-CAN-TX0/S-PWM-4/I2S0-BCLK/S-PL-EINT4)* AM8(PL7/S-JTAG-DI/S-PWM-7/I2S0-DOUT1/I2S0-DIN0/DMIC-DATA1/S-PL-EINT7)* AM14(REFCLK-OUT)* AM15(PI4/UART5-RTS/SPI1-MOSI/PWM-5/I2S2-DOUT0/I2S2-DIN1/PI-EINT4)* AM16(PI9/TWI5-SDA/DMIC-DATA2/PWM-10/PI-EINT9)* AM17(PI11/UART3-TX/DMIC-DATA0/PWM-12/PI-EINT11)* AM18(PI14/UART6-RTS/DMIC-CLK/PWM-15/PI-EINT14)* AM33(SA7)* AN4(PM4/S-PWM-8/S-RJTAG-DO/S-TWI2-SCK/S-PM-EINT4)* AN7(PL2/S-UART0-TX/S-UART1-TX/S-PWM-2/S-PL-EINT2)* AN8(PL6/S-JTAG-DO/S-PWM-6/I2S0-DIN1/I2S0-DOUT0/DMIC-DATA2/S-PL-EINT6)* AN15(PI3/UART5-RX/SPI1-CLK/PWM-4/I2S2-LRCK/PI-EINT3)* AN17(PI10/OWA-OUT/DMIC-DATA1/PWM-11/I2S2-MCLK/PI-EINT10)* AN26(SBG0)* B6(PK19/MCSID-D0P/TWI2-SCK/UART6-RX/NCSI-D3/PK-EINT19)* B7(PK16/MCSIC-CKN/TWI5-SCK/UART5-TX/NCSI-D0/PK-EINT16)* B8(PK15/MCSIC-D1P/UART7-CTS/UART5-CTS/NCSI-VSYNC/PK-EINT15)* B9(PK12/MCSIC-D0N/UART7-TX/TWI4-SCK/NCSI-PCLK/PK-EINT12)* B15(PH13/TWI3-SDA/I2S3-MCLK/RGMII0-EPHY-25M/PH-EINT13)* C7(PK17/MCSIC-CKP/TWI5-SDA/UART5-RX/NCSI-D1/PK-EINT17)* C9(PK13/MCSIC-D0P/UART7-RX/TWI4-SDA/NCSI-MCLK/PK-EINT13)* C15(PH12/DMIC-DATA3/TWI3-SCK/I2S2-DIN0/I2S2-DOUT1/PCIE0-WAKEN/PH-EINT12)* G4(PJ10/LCD1-D10/LVDS3-D0P/RGMII1-EPHY-25M/PJ-EINT10)* G16(JTAG-SEL)* J2(PJ17/LCD1-D17/LVDS3-CKN/PJ-EINT17)* M3(PJ24/LCD1-CLK/TWI4-SCK/UART4-TX/SPI0-CS1/PJ-EINT24)* N1(PJ27/LCD1-VSYNC/TWI5-SDA/UART4-CTS/PJ-EINT27)* N4(PJ18/LCD1-D18/LVDS3-D3P/PJ-EINT18)* N5(PJ19/LCD1-D19/LVDS3-D3N/PJ-EINT19)* N31(PB4/TWI1-SCK/I2S0-MCLK/TRACE-DATA2/PWM-8/HDMI-SCL/PB-EINT4)* N32(PB5/TWI1-SDA/I2S0-BCLK/TRACE-CLK/PWM-9/HDMI-SDA/PB-EINT5)* N33(PB6/I2S0-LRCK/TRACE-DATA0/PWM-10/HDMI-CEC/PB-EINT6)* U28(PC4/NAND-CE0/SPI0-MISO/SPIF-MISO/PC-EINT4)* U29(PC3/NAND-CE1/SPI0-CS0/SPIF-CS0/PC-EINT3)* U30(PC2/NAND-CLE/SPI0-MOSI/SPIF-MOSI/PC-EINT2)* U33(PC12/NAND-DQS/SPI0-CLK/SPIF-CLK/PC-EINT12)* W4(GPADC3)* W5(GPADC4)* W6(GPADC5)* W29(PC7/NAND-RB1/SPI0-CS1/SPIF-DQS/PC-EINT7)* Y2(GPADC6)* Y3(GPADC7)*; UD1 A1(NC0)* A2(NC1)* A11(NC2)* A12(NC3)* AA1(NC11)* AA12(NC12)* AB1(NC13)* AB2(NC14)* AB11(NC15)* AB12(NC16)* B1(NC4)* B12(NC5)* G11(NC6)* K5(NC7)* K8(NC8)* N5(NC9)* N8(NC10)*

## Notes on the sheets
sheet 1
- 1.8V
- 1.8V
- 0.9V
- 0.9V
- 0.9V
- FB远端反馈，靠近DRAM
- 1.8V
- 1.8V
- 1.8V
- 软件调整
- 1.8V
- 3.3V
- 3.3V
- 3.3V
- 1.8V
- 0.9V
- 0.9V
- 1.8V
sheet 2
- try default order:(selected fail media will not try)
  EMMC_USER->EMMC_BOOT->SLC NAND->MLC NAND->SPI NOR->SPI NAND
- JTAG-SEL默认为高电平，默认浮空；若要配置为低电平，直接接地即可。此信号为敏感信号，易
  受ESD等干扰，禁止在实际产品中引出一段浮空走线。
  TEST为内部测试引脚，实际应用请做悬空处理，禁止引出一段浮空走线。
  FEL/LRADC模块信号接按键时要接1nF去抖动电容，请勿删除或者更改为其他容值。
  BOOT_SEL_ADC为存储介质启动先后顺序配置脚，用于调整NAND和EMMC的启动顺序，可以
  根据产品的需求进行相关配置。T527默认开启BOOT_SEL_ADC pin识别启动顺序。
- R1
- R2
sheet 3
- T527支持DDR3/3L、DDR4、LPDDR3、LPDDR4、LPDDR4x，使用时需先确定DRAM的类型、片选及位宽
  DRAM上电时序请严格参照标案原理图设计。LPDDR3、LPDDR4、LPDDR4x颗粒需要的VDD18-LPDDR电源使用BLDO2供电；
  DDR4颗粒需要的VCC25-DRAM电源需外挂LDO供电，
  使用AXP717B BLDO2使能控制输出；LPDDR4x颗粒需要的VCC-DRAML电源需外挂DCDC供电，使用AXP717B BLDO2使能控制输出。
  DRAM外部分立器件的数量、值大小以及精度不允许随意更改，请严格参照标案原理图设计。
  DRAM所有的滤波电容不能删减，预留的滤波电容建议在开发阶段预留调试，但可以不贴片，待开发测试验证稳定之后，量产可以根据实际情况酌情删除
